# Altium project BBB_Board.PrjPCB (part 1 of 2)
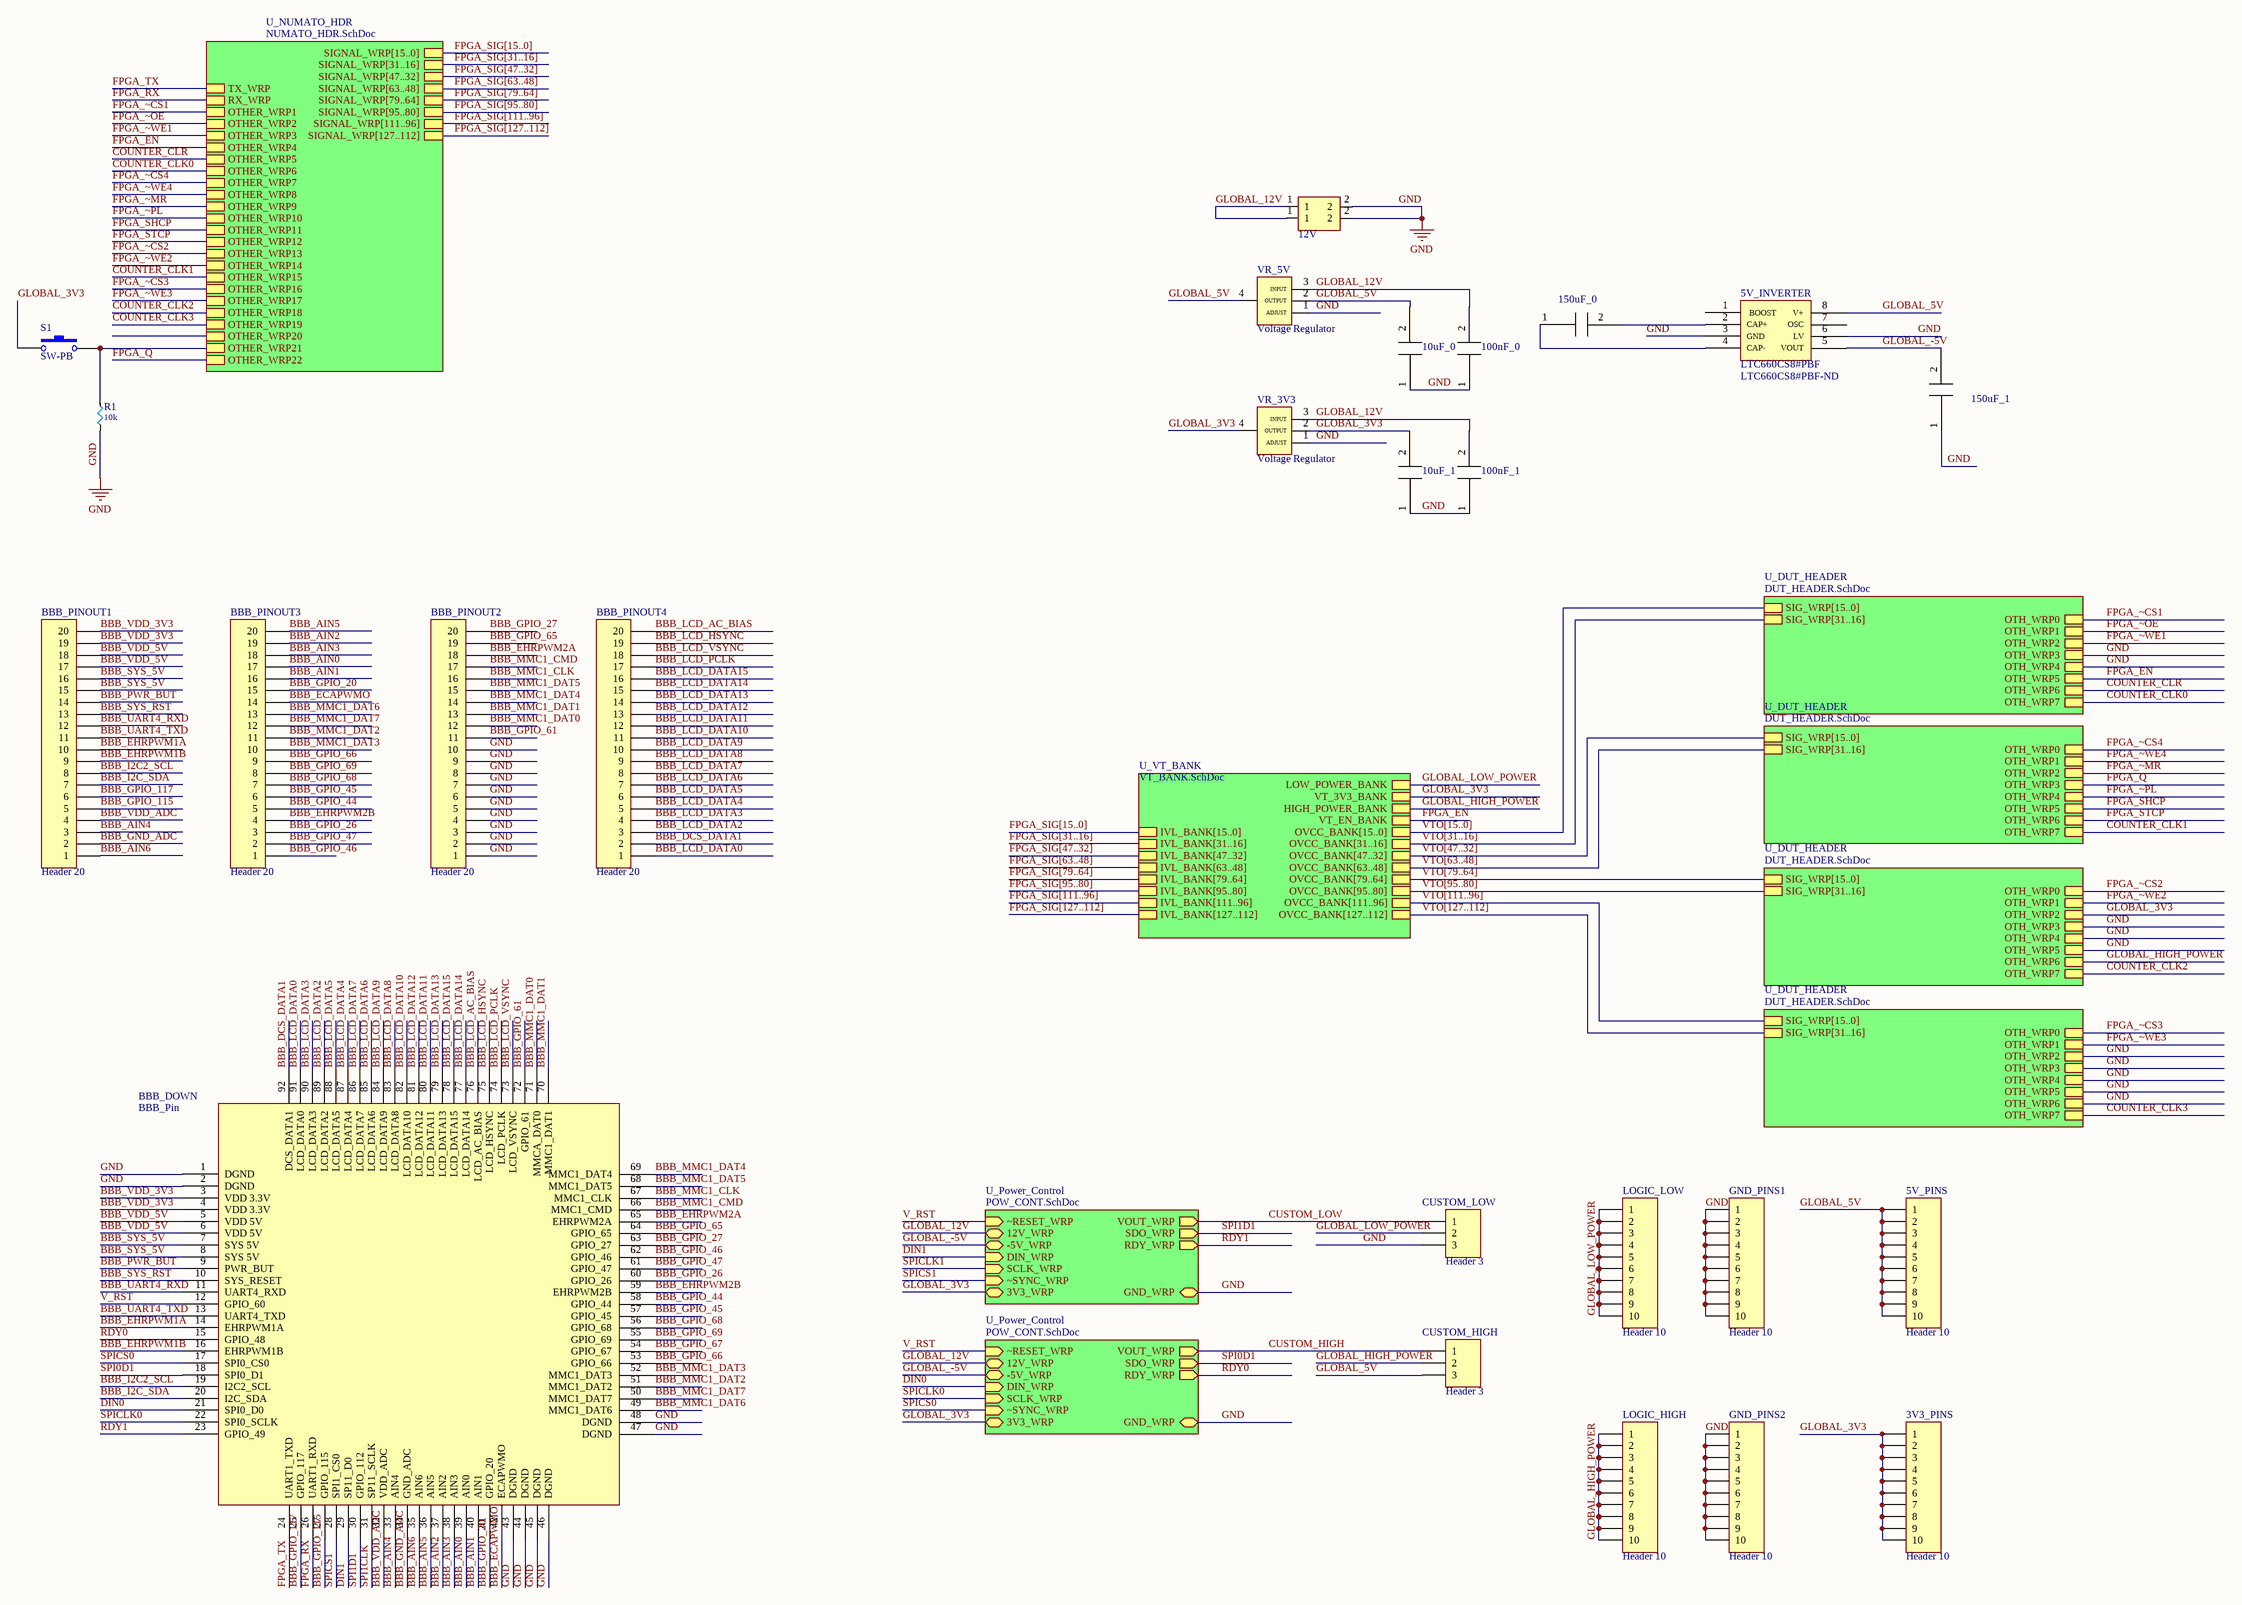
[diagram p0: BBB_Board.SchDoc]
6 sheets, 103 parts. Net scope: hierarchical (ports join the sheet entries above them; power ports are global).
Board files: BBB_Board_NEW.PcbDoc, BBB_Board_NEW_PLANES.PcbDoc
Sheets:
  BBB_Board.SchDoc
    U_Power_Control = POW_CONT.SchDoc
    U_Power_Control = POW_CONT.SchDoc
    U_VT_BANK = VT_BANK.SchDoc
      U_VT_WRP = VT_WRP.SchDoc
      U_VT_WRP = VT_WRP.SchDoc
      U_VT_WRP = VT_WRP.SchDoc
      U_VT_WRP = VT_WRP.SchDoc
      U_VT_WRP = VT_WRP.SchDoc
      U_VT_WRP = VT_WRP.SchDoc
      U_VT_WRP = VT_WRP.SchDoc
      U_VT_WRP = VT_WRP.SchDoc
    U_DUT_HEADER = DUT_HEADER.SchDoc
    U_DUT_HEADER = DUT_HEADER.SchDoc
    U_DUT_HEADER = DUT_HEADER.SchDoc
    U_DUT_HEADER = DUT_HEADER.SchDoc
    U_NUMATO_HDR = NUMATO_HDR.SchDoc

## Sheet BBB_Board.SchDoc
size C

### Parts
3V3_PINS  Header 10  [HDR1X10]
5V_INVERTER  LTC660CS8#PBF  Supplier Part Number 1: LTC660CS8#PBF-ND  [SOIC127P600X175-8N]
5V_PINS  Header 10  [HDR1X10]
10uF_0  0.1uF_0603  [0.1uF_0603]  (value not drawn)
10uF_1  0.1uF_0603  [0.1uF_0603]  (value not drawn)
12V  PJ-002BH-SMT-TR  [CP-002BHPJCT-ND]  (value not drawn)
100nF_0  0.1uF_0603  [0.1uF_0603]  (value not drawn)
100nF_1  0.1uF_0603  [0.1uF_0603]  (value not drawn)
150uF_0  0.1uF_0603  [0.1uF_0603]  (value not drawn)
150uF_1  0.1uF_0603  [0.1uF_0603]  (value not drawn)
BBB_DOWN  BBB_Pin  [BBB_Pin]
BBB_PINOUT1  Header 20  [HDR1X20]
BBB_PINOUT2  Header 20  [HDR1X20]
BBB_PINOUT3  Header 20  [HDR1X20]
BBB_PINOUT4  Header 20  [HDR1X20]
CUSTOM_HIGH  Header 3  [HDR1X3]
CUSTOM_LOW  Header 3  [HDR1X3]
GND_PINS1  Header 10  [HDR1X10]
GND_PINS2  Header 10  [HDR1X10]
LOGIC_HIGH  Header 10  [HDR1X10]
LOGIC_LOW  Header 10  [HDR1X10]
R1  Resistance (Ohms): 10k  [0.1uF_0603]  (hidden comment: RNCS0603BKE10K0)
S1  SW-PB  [SPST-2]
VR_3V3  Voltage Regulator  [volt_reg]
VR_5V  Voltage Regulator  [volt_reg]

### Sub-sheets
U_DUT_HEADER = DUT_HEADER.SchDoc: SIG_WRP[15..0], SIG_WRP[31..16], OTH_WRP0, OTH_WRP1, OTH_WRP2, OTH_WRP3, OTH_WRP4, OTH_WRP5, OTH_WRP6, OTH_WRP7
U_DUT_HEADER = DUT_HEADER.SchDoc: SIG_WRP[15..0], SIG_WRP[31..16], OTH_WRP0, OTH_WRP1, OTH_WRP2, OTH_WRP3, OTH_WRP4, OTH_WRP5, OTH_WRP6, OTH_WRP7
U_DUT_HEADER = DUT_HEADER.SchDoc: SIG_WRP[15..0], SIG_WRP[31..16], OTH_WRP0, OTH_WRP1, OTH_WRP2, OTH_WRP3, OTH_WRP4, OTH_WRP5, OTH_WRP6, OTH_WRP7
U_DUT_HEADER = DUT_HEADER.SchDoc: SIG_WRP[15..0], SIG_WRP[31..16], OTH_WRP0, OTH_WRP1, OTH_WRP2, OTH_WRP3, OTH_WRP4, OTH_WRP5, OTH_WRP6, OTH_WRP7
U_NUMATO_HDR = NUMATO_HDR.SchDoc: SIGNAL_WRP[15..0], SIGNAL_WRP[31..16], SIGNAL_WRP[47..32], SIGNAL_WRP[63..48], SIGNAL_WRP[79..64], SIGNAL_WRP[95..80], SIGNAL_WRP[111..96], SIGNAL_WRP[127..112], OTHER_WRP1, OTHER_WRP2, OTHER_WRP3, OTHER_WRP4, OTHER_WRP5, OTHER_WRP6, OTHER_WRP7, OTHER_WRP8, OTHER_WRP9, OTHER_WRP10, OTHER_WRP11, OTHER_WRP12, OTHER_WRP13, OTHER_WRP14, OTHER_WRP15, OTHER_WRP16, OTHER_WRP17, OTHER_WRP18, OTHER_WRP19, OTHER_WRP20, OTHER_WRP21, OTHER_WRP22, TX_WRP, RX_WRP
U_Power_Control = POW_CONT.SchDoc: ~RESET_WRP, VOUT_WRP, 12V_WRP, -5V_WRP, DIN_WRP, SCLK_WRP, ~SYNC_WRP, SDO_WRP, RDY_WRP, 3V3_WRP, GND_WRP
U_Power_Control = POW_CONT.SchDoc: ~RESET_WRP, VOUT_WRP, 12V_WRP, -5V_WRP, DIN_WRP, SCLK_WRP, ~SYNC_WRP, SDO_WRP, RDY_WRP, 3V3_WRP, GND_WRP
U_VT_BANK = VT_BANK.SchDoc: VT_3V3_BANK, HIGH_POWER_BANK, VT_EN_BANK, OVCC_BANK[15..0], OVCC_BANK[31..16], OVCC_BANK[47..32], OVCC_BANK[63..48], OVCC_BANK[79..64], OVCC_BANK[95..80], OVCC_BANK[111..96], OVCC_BANK[127..112], IVL_BANK[15..0], IVL_BANK[31..16], IVL_BANK[47..32], IVL_BANK[63..48], IVL_BANK[79..64], IVL_BANK[95..80], IVL_BANK[111..96], IVL_BANK[127..112], LOW_POWER_BANK

### Nets
GND: 5V_INVERTER.3(GND) 5V_INVERTER.6(LV) 10uF_0.1 10uF_1.1 12V.2 100nF_0.1 100nF_1.1 150uF_1.1 BBB_DOWN.1(DGND) BBB_DOWN.2(DGND) BBB_DOWN.43(DGND) BBB_DOWN.44(DGND) BBB_DOWN.45(DGND) BBB_DOWN.46(DGND) BBB_DOWN.47(DGND) BBB_DOWN.48(DGND) BBB_PINOUT2.1 BBB_PINOUT2.2 BBB_PINOUT2.3 BBB_PINOUT2.4 BBB_PINOUT2.5 BBB_PINOUT2.6 BBB_PINOUT2.7 BBB_PINOUT2.8 BBB_PINOUT2.9 BBB_PINOUT2.10 CUSTOM_LOW.3 GND_PINS1.1 GND_PINS1.2 GND_PINS1.3 GND_PINS1.4 GND_PINS1.5 GND_PINS1.6 GND_PINS1.7 GND_PINS1.8 GND_PINS1.9 GND_PINS1.10 GND_PINS2.1 GND_PINS2.2 GND_PINS2.3 GND_PINS2.4 GND_PINS2.5 GND_PINS2.6 GND_PINS2.7 GND_PINS2.8 GND_PINS2.9 GND_PINS2.10 R1.1 VR_3V3.1(ADJUST) VR_5V.1(ADJUST) ; sheet U_Power_Control/GND_WRP, sheet U_Power_Control/GND_WRP, sheet U_DUT_HEADER/OTH_WRP3, sheet U_DUT_HEADER/OTH_WRP4, sheet U_DUT_HEADER/OTH_WRP3, sheet U_DUT_HEADER/OTH_WRP4, sheet U_DUT_HEADER/OTH_WRP5, sheet U_DUT_HEADER/OTH_WRP2, sheet U_DUT_HEADER/OTH_WRP3, sheet U_DUT_HEADER/OTH_WRP4, sheet U_DUT_HEADER/OTH_WRP5, sheet U_DUT_HEADER/OTH_WRP6
BBB_AIN0: BBB_DOWN.39(AIN0) BBB_PINOUT3.17
BBB_AIN1: BBB_DOWN.40(AIN1) BBB_PINOUT3.16
BBB_AIN2: BBB_DOWN.37(AIN2) BBB_PINOUT3.19
BBB_AIN3: BBB_DOWN.38(AIN3) BBB_PINOUT3.18
BBB_AIN4: BBB_DOWN.33(AIN4) BBB_PINOUT1.3
BBB_AIN5: BBB_DOWN.36(AIN5) BBB_PINOUT3.20
BBB_AIN6: BBB_DOWN.35(AIN6) BBB_PINOUT1.1
BBB_DCS_DATA1: BBB_DOWN.92(DCS_DATA1) BBB_PINOUT4.2
BBB_ECAPWMO: BBB_DOWN.42(ECAPWMO) BBB_PINOUT3.14
BBB_EHRPWM1A: BBB_DOWN.14(EHRPWM1A) BBB_PINOUT1.10
BBB_EHRPWM1B: BBB_DOWN.16(EHRPWM1B) BBB_PINOUT1.9
BBB_EHRPWM2A: BBB_DOWN.65(EHRPWM2A) BBB_PINOUT2.18
BBB_EHRPWM2B: BBB_DOWN.59(EHRPWM2B) BBB_PINOUT3.4
BBB_GND_ADC: BBB_DOWN.34(GND_ADC) BBB_PINOUT1.2
BBB_GPIO_20: BBB_DOWN.41(GPIO_20) BBB_PINOUT3.15
BBB_GPIO_26: BBB_DOWN.60(GPIO_26) BBB_PINOUT3.3
BBB_GPIO_27: BBB_DOWN.63(GPIO_27) BBB_PINOUT2.20
BBB_GPIO_44: BBB_DOWN.58(GPIO_44) BBB_PINOUT3.5
BBB_GPIO_45: BBB_DOWN.57(GPIO_45) BBB_PINOUT3.6
BBB_GPIO_46: BBB_DOWN.62(GPIO_46) BBB_PINOUT3.1
BBB_GPIO_47: BBB_DOWN.61(GPIO_47) BBB_PINOUT3.2
BBB_GPIO_61: BBB_DOWN.72(GPIO_61) BBB_PINOUT2.11
BBB_GPIO_65: BBB_DOWN.64(GPIO_65) BBB_PINOUT2.19
BBB_GPIO_66: BBB_DOWN.53(GPIO_66) BBB_PINOUT3.9
BBB_GPIO_67: BBB_DOWN.54(GPIO_67)
BBB_GPIO_68: BBB_DOWN.56(GPIO_68) BBB_PINOUT3.7
BBB_GPIO_69: BBB_DOWN.55(GPIO_69) BBB_PINOUT3.8
BBB_GPIO_115: BBB_DOWN.27(GPIO_115) BBB_PINOUT1.5
BBB_GPIO_117: BBB_DOWN.25(GPIO_117) BBB_PINOUT1.6
BBB_I2C2_SCL: BBB_DOWN.19(I2C2_SCL) BBB_PINOUT1.8
BBB_I2C_SDA: BBB_DOWN.20(I2C_SDA) BBB_PINOUT1.7
BBB_LCD_AC_BIAS: BBB_DOWN.76(LCD_AC_BIAS) BBB_PINOUT4.20
BBB_LCD_DATA0: BBB_DOWN.91(LCD_DATA0) BBB_PINOUT4.1
BBB_LCD_DATA2: BBB_DOWN.89(LCD_DATA2) BBB_PINOUT4.3
BBB_LCD_DATA3: BBB_DOWN.90(LCD_DATA3) BBB_PINOUT4.4
BBB_LCD_DATA4: BBB_DOWN.87(LCD_DATA4) BBB_PINOUT4.5
BBB_LCD_DATA5: BBB_DOWN.88(LCD_DATA5) BBB_PINOUT4.6
BBB_LCD_DATA6: BBB_DOWN.85(LCD_DATA6) BBB_PINOUT4.7
BBB_LCD_DATA7: BBB_DOWN.86(LCD_DATA7) BBB_PINOUT4.8
BBB_LCD_DATA8: BBB_DOWN.83(LCD_DATA8) BBB_PINOUT4.9
BBB_LCD_DATA9: BBB_DOWN.84(LCD_DATA9) BBB_PINOUT4.10
BBB_LCD_DATA10: BBB_DOWN.82(LCD_DATA10) BBB_PINOUT4.11
BBB_LCD_DATA11: BBB_DOWN.80(LCD_DATA11) BBB_PINOUT4.12
BBB_LCD_DATA12: BBB_DOWN.81(LCD_DATA12) BBB_PINOUT4.13
BBB_LCD_DATA13: BBB_DOWN.79(LCD_DATA13) BBB_PINOUT4.14
BBB_LCD_DATA14: BBB_DOWN.77(LCD_DATA14) BBB_PINOUT4.15
BBB_LCD_DATA15: BBB_DOWN.78(LCD_DATA15) BBB_PINOUT4.16
BBB_LCD_HSYNC: BBB_DOWN.75(LCD_HSYNC) BBB_PINOUT4.19
BBB_LCD_PCLK: BBB_DOWN.74(LCD_PCLK) BBB_PINOUT4.17
BBB_LCD_VSYNC: BBB_DOWN.73(LCD_VSYNC) BBB_PINOUT4.18
BBB_MMC1_CLK: BBB_DOWN.67(MMC1_CLK) BBB_PINOUT2.16
BBB_MMC1_CMD: BBB_DOWN.66(MMC1_CMD) BBB_PINOUT2.17
BBB_MMC1_DAT0: BBB_DOWN.71(MMCA_DAT0) BBB_PINOUT2.12
BBB_MMC1_DAT1: BBB_DOWN.70(MMC1_DAT1) BBB_PINOUT2.13
BBB_MMC1_DAT2: BBB_DOWN.51(MMC1_DAT2) BBB_PINOUT3.11
BBB_MMC1_DAT3: BBB_DOWN.52(MMC1_DAT3) BBB_PINOUT3.10
BBB_MMC1_DAT4: BBB_DOWN.69(MMC1_DAT4) BBB_PINOUT2.14
BBB_MMC1_DAT5: BBB_DOWN.68(MMC1_DAT5) BBB_PINOUT2.15
BBB_MMC1_DAT6: BBB_DOWN.49(MMC1_DAT6) BBB_PINOUT3.13
BBB_MMC1_DAT7: BBB_DOWN.50(MMC1_DAT7) BBB_PINOUT3.12
BBB_PWR_BUT: BBB_DOWN.9(PWR_BUT) BBB_PINOUT1.14
BBB_SYS_5V: BBB_DOWN.7(SYS_5V) BBB_DOWN.8(SYS_5V) BBB_PINOUT1.15 BBB_PINOUT1.16
BBB_SYS_RST: BBB_DOWN.10(SYS_RESET) BBB_PINOUT1.13
BBB_UART4_RXD: BBB_DOWN.11(UART4_RXD) BBB_PINOUT1.12
BBB_UART4_TXD: BBB_DOWN.13(UART4_TXD) BBB_PINOUT1.11
BBB_VDD_3V3: BBB_DOWN.3(VDD_3.3V) BBB_DOWN.4(VDD_3.3V) BBB_PINOUT1.19 BBB_PINOUT1.20
BBB_VDD_5V: BBB_DOWN.5(VDD_5V) BBB_DOWN.6(VDD_5V) BBB_PINOUT1.17 BBB_PINOUT1.18
BBB_VDD_ADC: BBB_DOWN.32(VDD_ADC) BBB_PINOUT1.4
COUNTER_CLK0: sheet U_DUT_HEADER/OTH_WRP7, sheet U_NUMATO_HDR/OTHER_WRP6
COUNTER_CLK1: sheet U_DUT_HEADER/OTH_WRP7, sheet U_NUMATO_HDR/OTHER_WRP15
COUNTER_CLK2: sheet U_DUT_HEADER/OTH_WRP7, sheet U_NUMATO_HDR/OTHER_WRP18
COUNTER_CLK3: sheet U_DUT_HEADER/OTH_WRP7, sheet U_NUMATO_HDR/OTHER_WRP19
COUNTER_CLR: sheet U_DUT_HEADER/OTH_WRP6, sheet U_NUMATO_HDR/OTHER_WRP5
CUSTOM_HIGH: CUSTOM_HIGH.1 ; sheet U_Power_Control/VOUT_WRP
CUSTOM_LOW: CUSTOM_LOW.1 ; sheet U_Power_Control/VOUT_WRP
DIN0: BBB_DOWN.21(SPI0_D0) ; sheet U_Power_Control/DIN_WRP
DIN1: BBB_DOWN.29(SP11_D0) ; sheet U_Power_Control/DIN_WRP
FPGA_EN: sheet U_VT_BANK/VT_EN_BANK, sheet U_DUT_HEADER/OTH_WRP5, sheet U_NUMATO_HDR/OTHER_WRP4
FPGA_Q: sheet U_DUT_HEADER/OTH_WRP3, sheet U_NUMATO_HDR/OTHER_WRP22
FPGA_RX: BBB_DOWN.26(UART1_RXD) ; sheet U_NUMATO_HDR/RX_WRP
FPGA_SHCP: sheet U_DUT_HEADER/OTH_WRP5, sheet U_NUMATO_HDR/OTHER_WRP11
FPGA_STCP: sheet U_DUT_HEADER/OTH_WRP6, sheet U_NUMATO_HDR/OTHER_WRP12
FPGA_TX: BBB_DOWN.24(UART1_TXD) ; sheet U_NUMATO_HDR/TX_WRP
FPGA_~CS1: sheet U_DUT_HEADER/OTH_WRP0, sheet U_NUMATO_HDR/OTHER_WRP1
FPGA_~CS2: sheet U_DUT_HEADER/OTH_WRP0, sheet U_NUMATO_HDR/OTHER_WRP13
FPGA_~CS3: sheet U_DUT_HEADER/OTH_WRP0, sheet U_NUMATO_HDR/OTHER_WRP16
FPGA_~CS4: sheet U_DUT_HEADER/OTH_WRP0, sheet U_NUMATO_HDR/OTHER_WRP7
FPGA_~MR: sheet U_DUT_HEADER/OTH_WRP2, sheet U_NUMATO_HDR/OTHER_WRP9
FPGA_~OE: sheet U_DUT_HEADER/OTH_WRP1, sheet U_NUMATO_HDR/OTHER_WRP2
FPGA_~PL: sheet U_DUT_HEADER/OTH_WRP4, sheet U_NUMATO_HDR/OTHER_WRP10
FPGA_~WE1: sheet U_DUT_HEADER/OTH_WRP2, sheet U_NUMATO_HDR/OTHER_WRP3
FPGA_~WE2: sheet U_DUT_HEADER/OTH_WRP1, sheet U_NUMATO_HDR/OTHER_WRP14
FPGA_~WE3: sheet U_DUT_HEADER/OTH_WRP1, sheet U_NUMATO_HDR/OTHER_WRP17
FPGA_~WE4: sheet U_DUT_HEADER/OTH_WRP1, sheet U_NUMATO_HDR/OTHER_WRP8
GLOBAL_3V3: 3V3_PINS.1 3V3_PINS.2 3V3_PINS.3 3V3_PINS.4 3V3_PINS.5 3V3_PINS.6 3V3_PINS.7 3V3_PINS.8 3V3_PINS.9 3V3_PINS.10 10uF_1.2 S1.1 VR_3V3.2(OUTPUT) VR_3V3.4(Output) ; sheet U_Power_Control/3V3_WRP, sheet U_Power_Control/3V3_WRP, sheet U_VT_BANK/VT_3V3_BANK, sheet U_DUT_HEADER/OTH_WRP2  [project net 3V3_W]
GLOBAL_5V: 5V_INVERTER.8(V+) 5V_PINS.1 5V_PINS.2 5V_PINS.3 5V_PINS.4 5V_PINS.5 5V_PINS.6 5V_PINS.7 5V_PINS.8 5V_PINS.9 5V_PINS.10 10uF_0.2 CUSTOM_HIGH.3 VR_5V.2(OUTPUT) VR_5V.4(Output)
GLOBAL_12V: 12V.1 100nF_0.2 100nF_1.2 VR_3V3.3(INPUT) VR_5V.3(INPUT) ; sheet U_Power_Control/12V_WRP, sheet U_Power_Control/12V_WRP  [project net 12V_W]
GLOBAL_-5V: 5V_INVERTER.5(VOUT) 150uF_1.2 ; sheet U_Power_Control/-5V_WRP, sheet U_Power_Control/-5V_WRP  [project net -5V_W]
GLOBAL_HIGH_POWER: CUSTOM_HIGH.2 LOGIC_HIGH.1 LOGIC_HIGH.2 LOGIC_HIGH.3 LOGIC_HIGH.4 LOGIC_HIGH.5 LOGIC_HIGH.6 LOGIC_HIGH.7 LOGIC_HIGH.8 LOGIC_HIGH.9 LOGIC_HIGH.10 ; sheet U_VT_BANK/HIGH_POWER_BANK, sheet U_DUT_HEADER/OTH_WRP6
GLOBAL_LOW_POWER: CUSTOM_LOW.2 LOGIC_LOW.1 LOGIC_LOW.2 LOGIC_LOW.3 LOGIC_LOW.4 LOGIC_LOW.5 LOGIC_LOW.6 LOGIC_LOW.7 LOGIC_LOW.8 LOGIC_LOW.9 LOGIC_LOW.10 ; sheet U_VT_BANK/LOW_POWER_BANK
OTHER_W21: R1.2 S1.2 ; sheet U_NUMATO_HDR/OTHER_WRP21
RDY0: BBB_DOWN.15(GPIO_48) ; sheet U_Power_Control/RDY_WRP
RDY1: BBB_DOWN.23(GPIO_49) ; sheet U_Power_Control/RDY_WRP
SPI0D1: BBB_DOWN.18(SPI0_D1) ; sheet U_Power_Control/SDO_WRP  [project net SDO_W]
SPI1CLK: BBB_DOWN.31(SP11_SCLK)
SPI1D1: BBB_DOWN.30(GPIO_112) ; sheet U_Power_Control/SDO_WRP  [project net SDO_W]
SPICLK0: BBB_DOWN.22(SPI0_SCLK) ; sheet U_Power_Control/SCLK_WRP  [project net SCLK_W]
SPICS0: BBB_DOWN.17(SPI0_CS0) ; sheet U_Power_Control/~SYNC_WRP
SPICS1: BBB_DOWN.28(SPI1_CS0) ; sheet U_Power_Control/~SYNC_WRP
V_RST: BBB_DOWN.12(GPIO_60) ; sheet U_Power_Control/~RESET_WRP, sheet U_Power_Control/~RESET_WRP
Net5V_INVERTER_2: 5V_INVERTER.2(CAP+) 150uF_0.2
Net5V_INVERTER_4: 5V_INVERTER.4(CAP-) 150uF_0.1

Not connected (* = marked no-connect by the designer): 5V_INVERTER 1(BOOST) 7(OSC)

### Buses and harness runs
bus FPGA_SIG[15..0] = sheet U_NUMATO_HDR/SIGNAL_WRP[15..0]
bus FPGA_SIG[15..0] = sheet U_VT_BANK/IVL_BANK[15..0]
bus FPGA_SIG[31..16] = sheet U_NUMATO_HDR/SIGNAL_WRP[31..16]
bus FPGA_SIG[31..16] = sheet U_VT_BANK/IVL_BANK[31..16]
bus FPGA_SIG[47..32] = sheet U_NUMATO_HDR/SIGNAL_WRP[47..32]
bus FPGA_SIG[47..32] = sheet U_VT_BANK/IVL_BANK[47..32]
bus FPGA_SIG[63..48] = sheet U_NUMATO_HDR/SIGNAL_WRP[63..48]
bus FPGA_SIG[63..48] = sheet U_VT_BANK/IVL_BANK[63..48]
bus FPGA_SIG[79..64] = sheet U_NUMATO_HDR/SIGNAL_WRP[79..64]
bus FPGA_SIG[79..64] = sheet U_VT_BANK/IVL_BANK[79..64]
bus FPGA_SIG[95..80] = sheet U_NUMATO_HDR/SIGNAL_WRP[95..80]
bus FPGA_SIG[95..80] = sheet U_VT_BANK/IVL_BANK[95..80]
bus FPGA_SIG[111..96] = sheet U_NUMATO_HDR/SIGNAL_WRP[111..96]
bus FPGA_SIG[111..96] = sheet U_VT_BANK/IVL_BANK[111..96]
bus FPGA_SIG[127..112] = sheet U_NUMATO_HDR/SIGNAL_WRP[127..112]
bus FPGA_SIG[127..112] = sheet U_VT_BANK/IVL_BANK[127..112]
bus VTO[15..0] = sheet U_DUT_HEADER/SIG_WRP[15..0] = sheet U_VT_BANK/OVCC_BANK[15..0]
bus VTO[31..16] = sheet U_DUT_HEADER/SIG_WRP[31..16] = sheet U_VT_BANK/OVCC_BANK[31..16]
bus VTO[47..32] = sheet U_DUT_HEADER/SIG_WRP[15..0] = sheet U_VT_BANK/OVCC_BANK[47..32]
bus VTO[63..48] = sheet U_DUT_HEADER/SIG_WRP[31..16] = sheet U_VT_BANK/OVCC_BANK[63..48]
bus VTO[79..64] = sheet U_DUT_HEADER/SIG_WRP[15..0] = sheet U_VT_BANK/OVCC_BANK[79..64]
bus VTO[95..80] = sheet U_DUT_HEADER/SIG_WRP[31..16] = sheet U_VT_BANK/OVCC_BANK[95..80]
bus VTO[111..96] = sheet U_DUT_HEADER/SIG_WRP[15..0] = sheet U_VT_BANK/OVCC_BANK[111..96]
bus VTO[127..112] = sheet U_DUT_HEADER/SIG_WRP[31..16] = sheet U_VT_BANK/OVCC_BANK[127..112]

### Library data of the parts
3V3_PINS 5V_PINS GND_PINS1 GND_PINS2 LOGIC_HIGH LOGIC_LOW = Header 10: Header, 10-Pin; LatestRevisionDate: 17-Jul-2002; LatestRevisionNote: Re-released for DXP Platform.; Publisher: Altium Limited
5V_INVERTER = LTC660CS8#PBF: IC REG SWTCHD CAP INV 0.1A 8SOIC; Manufacturer: Linear Technology; Function: Ratiometric; Output Configuration: Positive or Negative; Topology: Charge Pump; Output Type: Fixed; Number of Outputs: 1; Voltage - Input (Min): 1.5V, 2.5V; Voltage - Input (Max): 5.5V; Voltage - Output (Min/Fixed): -Vin, 2Vin, Vin/2; Current - Output: 100mA; Frequency - Switching: 10kHz, 80kHz; Synchronous Rectifier: No; Supplier 1: Digi-Key; Manufacturer Part Number: LTC660CS8#PBF; RoHS: RoHS Compliant; Category: Integrated Circuits (ICs); Stock 1: 5170; Pricing 1: 1=5.53, 25=3.6704, 100=3.14 (USD); Packaging: Tube; Voltage - Output (Max): -; Operating Temperature: 0°C ~ 70°C (TA); Mounting Type: Surface Mount; Package / Case: 8-SOIC (0.154", 3.90mm Width); Supplier Device Package: 8-SOIC; ComponentLink1URL: http://www.linear.com/docs/1870; ComponentLink1Description: http://www.linear.com/docs/1870
12V = PJ-002BH-SMT-TR: CONN POWER JACK 2.5X5.5MM HI CUR; Manufacturer: CUI Inc; Gender: Male; Plug/Mating Plug Diameter: 2.5mm ID, 5.5mm OD; Number of Positions/Contacts: 2 Conductors, 3 Contacts; Internal Switch(s): Single Switch, Normally Closed; Shielding: Unshielded; Voltage - Rated: 24VDC; Current Rating: 5A; Supplier 1: Digi-Key; Manufacturer Part Number: PJ-002BH-SMT-TR; RoHS: RoHS Compliant; Category: Connectors, Interconnects; Stock 1: 6300; Pricing 1: 350=0.8588, 700=0.8136, 1050=0.7232, 1750=0.6554, 2450=0.60116, 8750=0.5763, 17500=0.565 (USD); Connector Type: Jack; Mounting Type: Surface Mount, Right Angle; Termination: Solder; Features: -; Color: Black; Contact Material: Copper Alloy; Contact Material - Plating: Nickel; Housing Color: Black; Housing Material: Thermoplastic; Operating Temperature: -25°C ~ 85°C; ComponentLink1URL: http://www.cui.com/product/resource/digikeypdf/pj-002bh-smt.pdf; ComponentLink1Description: http://www.cui.com/product/resource/digikeypdf/pj-002bh-smt.pdf; Supplier Part Number 1: CP-002BHPJTR-ND
BBB_PINOUT1-BBB_PINOUT4 = Header 20: Header, 20-Pin; LatestRevisionDate: 17-Jul-2002; LatestRevisionNote: Re-released for DXP Platform.; Publisher: Altium Limited
CUSTOM_HIGH CUSTOM_LOW = Header 3: Header, 3-Pin; LatestRevisionDate: 17-Jul-2002; LatestRevisionNote: Re-released for DXP Platform.; Publisher: Altium Limited
R1 = RNCS0603BKE10K0: RES 10K OHM 1/16W 0.1% 0603; Manufacturer: Stackpole Electronics Inc; Power (Watts): 0.063W, 1/16W; Temperature Coefficient: ±25ppm/°C; Supplier 1: Digi-Key; Manufacturer Part Number: RNCS0603BKE10K0; RoHS: RoHS Compliant; Category: Resistors; Stock 1: 32000; Pricing 1: 1000=0.08, 2000=0.075, 5000=0.0675, 10000=0.066, 25000=0.06375, 50000=0.0625, 100000=0.0619 (USD); Packaging: Tape & Reel (TR); Tolerance: ±0.1%; Composition: Thin Film; Features: Anti-Corrosive, Moisture Resistant; Package / Case: 0603 (1608 Metric); Supplier Device Package: 0603; Size / Dimension: 0.061" L x 0.031" W (1.55mm x 0.80mm); Height: 0.022" (0.55mm); Number of Terminations: 2; ComponentLink1URL: http://www.seielect.com/catalog/SEI-RNCS.pdf; ComponentLink1Description: http://www.seielect.com/catalog/SEI-RNCS.pdf; Supplier Part Number 1: RNCS0603BKE10K0TR-ND
S1 = SW-PB: Switch; Published: 24-Mar-1999; LatestRevisionDate: 17-Jul-2002; LatestRevisionNote: Re-released for DXP Platform.; PackageReference: SPST-2; Publisher: Altium Limited; PackageDescription: Switch; 2 Leads
VR_3V3 VR_5V = Voltage Regulator: IC REG LDO ADJ 1.5A DDPAK; Manufacturer: Texas Instruments; Manufacturer Part Number: LM317KTTR; Regulator Topology: Positive Adjustable; Voltage - Output: 1.25 V ~ 37 V; Number of Regulators: 1; Voltage - Input: 4.2 V ~ 40 V; Supplier 1: Digi-Key; RoHS: RoHS Compliant; Category: Integrated Circuits (ICs); Stock 1: 23750; Pricing 1: 1=0.93, 10=0.816, 100=0.624 (USD); Packaging: Cut Tape (CT); Current - Output: 1.5A; Voltage - Dropout (Typical): -; Current - Limit (Min): -; Operating Temperature: 0°C ~ 125°C; Mounting Type: Surface Mount; Package / Case: TO-263-4, D²Pak (3 Leads + Tab), TO-263AA; Supplier Device Package: DDPAK/TO-263-3; ComponentLink1URL: http://www.ti.com/lit/ds/symlink/lm317.pdf; ComponentLink1Description: http://www.ti.com/lit/ds/symlink/lm317.pdf; Supplier Part Number 1: 296-21390-1-ND

## Sheet POW_CONT.SchDoc
size A
Used 2 times, as channels U_Power_Control, U_Power_Control. Parts and nets are listed once, with the designators drawn on the sheet.
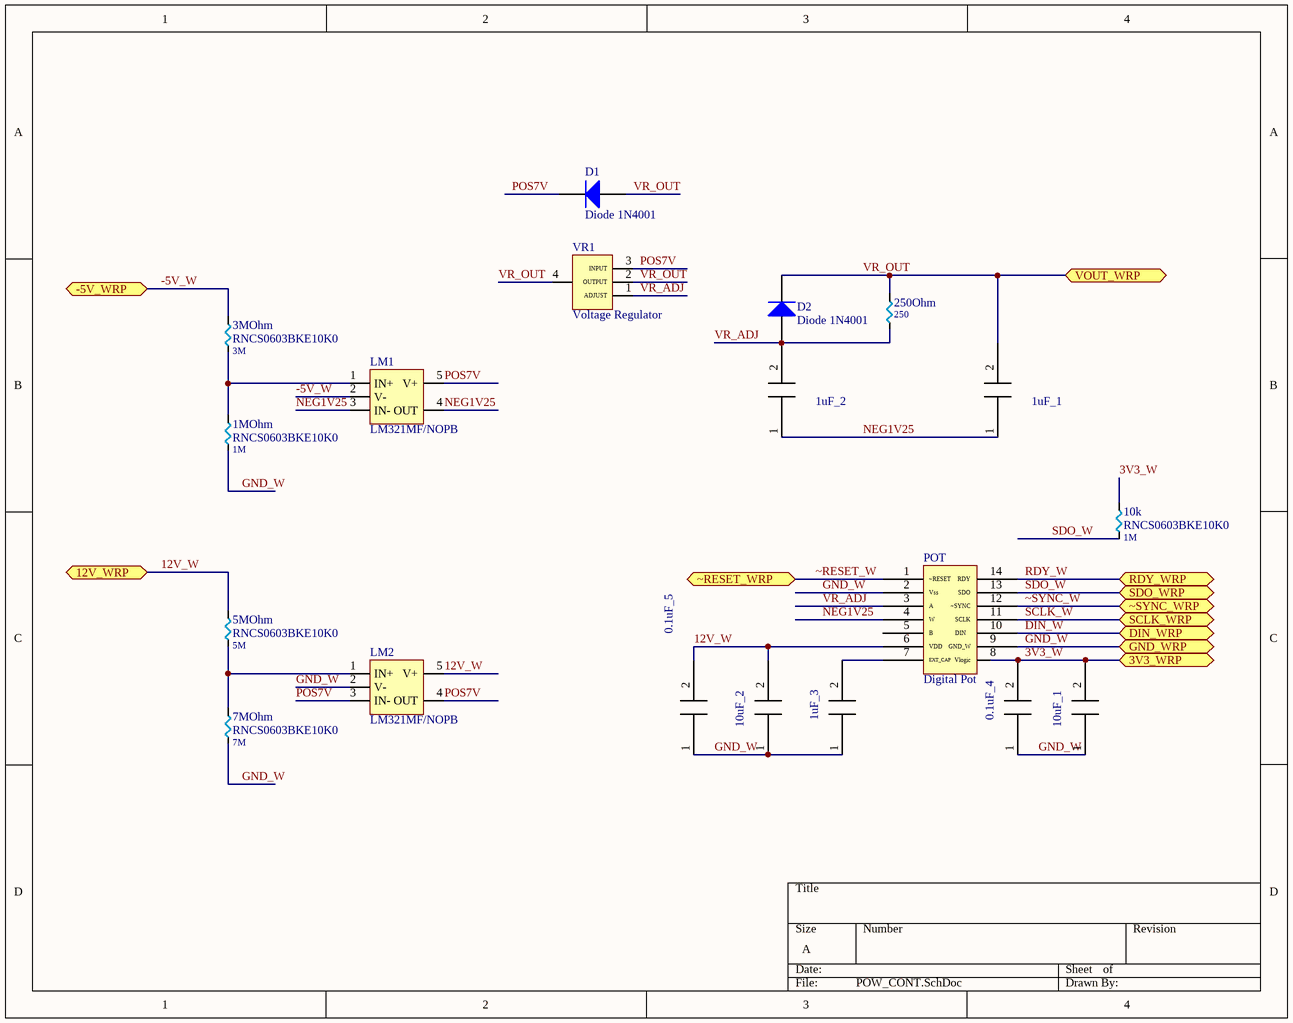
[diagram p1: POW_CONT.SchDoc]

### Parts
0.1uF_4  0.1uF_0603  [0.1uF_0603]  (value not drawn)
0.1uF_5  0.1uF_0603  [0.1uF_0603]  (value not drawn)
1MOhm  RNCS0603BKE10K0  Resistance (Ohms): 1M  [0.1uF_0603]
1uF_1  0.1uF_0603  [0.1uF_0603]  (value not drawn)
1uF_2  0.1uF_0603  [0.1uF_0603]  (value not drawn)
1uF_3  0.1uF_0603  [0.1uF_0603]  (value not drawn)
3MOhm  RNCS0603BKE10K0  Resistance (Ohms): 3M  [0.1uF_0603]
5MOhm  RNCS0603BKE10K0  Resistance (Ohms): 5M  [0.1uF_0603]
7MOhm  RNCS0603BKE10K0  Resistance (Ohms): 7M  [0.1uF_0603]
10k  RNCS0603BKE10K0  Resistance (Ohms): 1M  [0.1uF_0603]
10uF_1  0.1uF_0603  [0.1uF_0603]  (value not drawn)
10uF_2  0.1uF_0603  [0.1uF_0603]  (value not drawn)
250Ohm  Resistance (Ohms): 250  [0.1uF_0603]  (hidden comment: RNCS0603BKE10K0)
D1  Diode 1N4001  [DO-41]
D2  Diode 1N4001  [DO-41]
LM1  LM321MF/NOPB  [op_amp]
LM2  LM321MF/NOPB  [op_amp]
POT  Digital Pot  [Dig_Pot]
VR1  Voltage Regulator  [volt_reg]

### Ports
3V3_WRP, 12V_WRP, -5V_WRP, DIN_WRP, GND_WRP, RDY_WRP, SCLK_WRP, SDO_WRP, VOUT_WRP, ~RESET_WRP, ~SYNC_WRP

### Nets
3V3_W: 0.1uF_4.2 10k.2 10uF_1.2 POT.8(Vlogic) ; port 3V3_WRP
12V_W: 0.1uF_5.2 5MOhm.2 10uF_2.2 LM2.5(V+) POT.6(VDD) ; port 12V_WRP
-5V_W: 3MOhm.2 LM1.2(V-) ; port -5V_WRP
DIN_W: POT.10(DIN) ; port DIN_WRP
GND_W: 0.1uF_4.1 0.1uF_5.1 1MOhm.1 1uF_3.1 7MOhm.1 10uF_1.1 10uF_2.1 LM2.2(V-) POT.2(Vss) POT.9(GND_W) ; port GND_WRP
NEG1V25: 1uF_1.1 1uF_2.1 LM1.3(IN-) LM1.4(OUT) POT.4(W)
POS7V: D1.2(K) LM1.5(V+) LM2.3(IN-) LM2.4(OUT) VR1.3(INPUT)
RDY_W: POT.14(RDY) ; port RDY_WRP
SCLK_W: POT.11(SCLK) ; port SCLK_WRP
SDO_W: 10k.1 POT.13(SDO) ; port SDO_WRP
VR_ADJ: 1uF_2.2 250Ohm.1 D2.1(A) POT.3(A) VR1.1(ADJUST)
VR_OUT: 1uF_1.2 250Ohm.2 D1.1(A) D2.2(K) VR1.2(OUTPUT) VR1.4(Output) ; port VOUT_WRP
~RESET_W: POT.1(~RESET) ; port ~RESET_WRP
~SYNC_W: POT.12(~SYNC) ; port ~SYNC_WRP
Net1MOhm_2: 1MOhm.2 3MOhm.1 LM1.1(IN+)
Net1uF_3_2: 1uF_3.2 POT.7(EXT_CAP)
Net5MOhm_1: 5MOhm.1 7MOhm.2 LM2.1(IN+)

Not connected (* = marked no-connect by the designer): POT 5(B)

### Channels
U_Power_Control: designators end in _U_Power_Control2; ports 3V3_WRP=3V3_W 12V_WRP=12V_W -5V_WRP=-5V_W DIN_WRP=DIN0 GND_WRP=GND RDY_WRP=RDY0 SCLK_WRP=SCLK_W SDO_WRP=SDO_W VOUT_WRP=CUSTOM_HIGH ~RESET_WRP=V_RST ~SYNC_WRP=SPICS0
U_Power_Control: designators end in _U_Power_Control1; ports 3V3_WRP=3V3_W 12V_WRP=12V_W -5V_WRP=-5V_W DIN_WRP=DIN1 GND_WRP=GND RDY_WRP=RDY1 SCLK_WRP=SCLK_W_U_Power_Control SDO_WRP=SDO_W VOUT_WRP=CUSTOM_LOW ~RESET_WRP=V_RST ~SYNC_WRP=SPICS1

### Library data of the parts
1MOhm 3MOhm 5MOhm 7MOhm 10k 250Ohm = RNCS0603BKE10K0: as R1 on sheet BBB_Board; Supplier 1: Digi-Key; Manufacturer Part Number: RNCS0603BKE10K0; RoHS: RoHS Compliant; Category: Resistors; Stock 1: 32000; Pricing 1: 1000=0.08, 2000=0.075, 5000=0.0675, 10000=0.066, 25000=0.06375, 50000=0.0625, 100000=0.0619 (USD); Packaging: Tape & Reel (TR); Tolerance: ±0.1%; Composition: Thin Film; Features: Anti-Corrosive, Moisture Resistant; Package / Case: 0603 (1608 Metric); Supplier Device Package: 0603; Size / Dimension: 0.061" L x 0.031" W (1.55mm x 0.80mm); Height: 0.022" (0.55mm); Number of Terminations: 2; ComponentLink1URL: http://www.seielect.com/catalog/SEI-RNCS.pdf; ComponentLink1Description: http://www.seielect.com/catalog/SEI-RNCS.pdf; Supplier Part Number 1: RNCS0603BKE10K0TR-ND
D1 D2 = Diode 1N4001: 1 Amp General Purpose Rectifier; Published: 8-Jun-2000; LatestRevisionDate: 17-Jul-2002; LatestRevisionNote: Re-released for DXP Platform.; DatasheetVersion: 1998; PackageVersion: Aug-1999; PackageReference: DO-41; Publisher: Altium Limited; PackageDescription: Diode, Axial; Body 5.2 x 2.7 mm (LxDia. max), Lead Dia. 0.86 mm (max); Code_JEDEC: DO-204-AL; ComponentLink1Description: Manufacturer Link; ComponentLink1URL: http://www.fairchildsemi.com/; ComponentLink2Description: Datasheet; ComponentLink2URL: http://www.fairchildsemi.com/ds/1N%2F1N4001.pdf
LM1 LM2 = LM321MF/NOPB: IC OPAMP GP 1MHZ SOT23-5; Manufacturer: Texas Instruments; Amplifier Type: General Purpose; Number of Circuits: 1; Slew Rate: 0.4 V/µs; Current - Input Bias: 45nA; Voltage - Input Offset: 2mV; Current - Supply: 660µA; Current - Output / Channel: 40mA; Voltage - Supply, Single/Dual (±): 3 V ~ 30 V, ±1.5 V ~ 15 V; Supplier 1: Digi-Key; Manufacturer Part Number: LM321MF/NOPB; RoHS: RoHS Compliant; Category: Integrated Circuits (ICs); Stock 1: 14679; Pricing 1: 1=0.67, 10=0.573, 100=0.4277, 500=0.33596 (USD); Packaging: Cut Tape (CT); Output Type: -; Gain Bandwidth Product: 1MHz; -3db Bandwidth: -; Operating Temperature: -40°C ~ 85°C; Mounting Type: Surface Mount; Package / Case: SC-74A, SOT-753; Supplier Device Package: SOT-23-5; ComponentLink1URL: http://www.ti.com/lit/ds/symlink/lm321.pdf; ComponentLink1Description: http://www.ti.com/lit/ds/symlink/lm321.pdf; Supplier Part Number 1: LM321MF/NOPBCT-ND
POT = Digital Pot: IC DGTL POT 1024POS 20K 14TSSOP; Manufacturer: Analog Devices Inc.; Manufacturer Part Number: AD5293BRUZ-20; Configuration: Potentiometer; Number of Circuits: 1; Number of Taps: 1024; Interface: SPI; Memory Type: Volatile; Voltage - Supply: 9 V ~ 33 V, ±9 V ~ 16.5 V; Tolerance: ±7%; Temperature Coefficient (Typ): 35 ppm/°C; Resistance - Wiper (Ohms) (Typ): 60; Supplier 1: Digi-Key; RoHS: RoHS Compliant; Category: Integrated Circuits (ICs); Stock 1: 271; Pricing 1: 1=6.13, 96=5.27771, 192=4.5826, 576=3.99047, 1056=3.47558, 2592=3.34685, 5000=3.252 (USD); Packaging: Tube; Taper: Linear; Resistance (Ohms): 20k; Features: -; Operating Temperature: -40°C ~ 105°C; Package / Case: 14-TSSOP (0.173", 4.40mm Width); Supplier Device Package: 14-TSSOP; ComponentLink1URL: http://www.analog.com/media/en/technical-documentation/data-sheets/AD5293.pdf; ComponentLink1Description: http://www.analog.com/media/en/technical-documentation/data-sheets/AD5293.pdf; Supplier Part Number 1: AD5293BRUZ-20-ND
VR1 = Voltage Regulator: as VR_3V3 on sheet BBB_Board; Supplier 1: Digi-Key; RoHS: RoHS Compliant; Category: Integrated Circuits (ICs); Stock 1: 23750; Pricing 1: 1=0.93, 10=0.816, 100=0.624 (USD); Packaging: Cut Tape (CT); Current - Output: 1.5A; Voltage - Dropout (Typical): -; Current - Limit (Min): -; Operating Temperature: 0°C ~ 125°C; Mounting Type: Surface Mount; Package / Case: TO-263-4, D²Pak (3 Leads + Tab), TO-263AA; Supplier Device Package: DDPAK/TO-263-3; ComponentLink1URL: http://www.ti.com/lit/ds/symlink/lm317.pdf; ComponentLink1Description: http://www.ti.com/lit/ds/symlink/lm317.pdf; Supplier Part Number 1: 296-21390-1-ND

## Sheet VT_BANK.SchDoc
size B
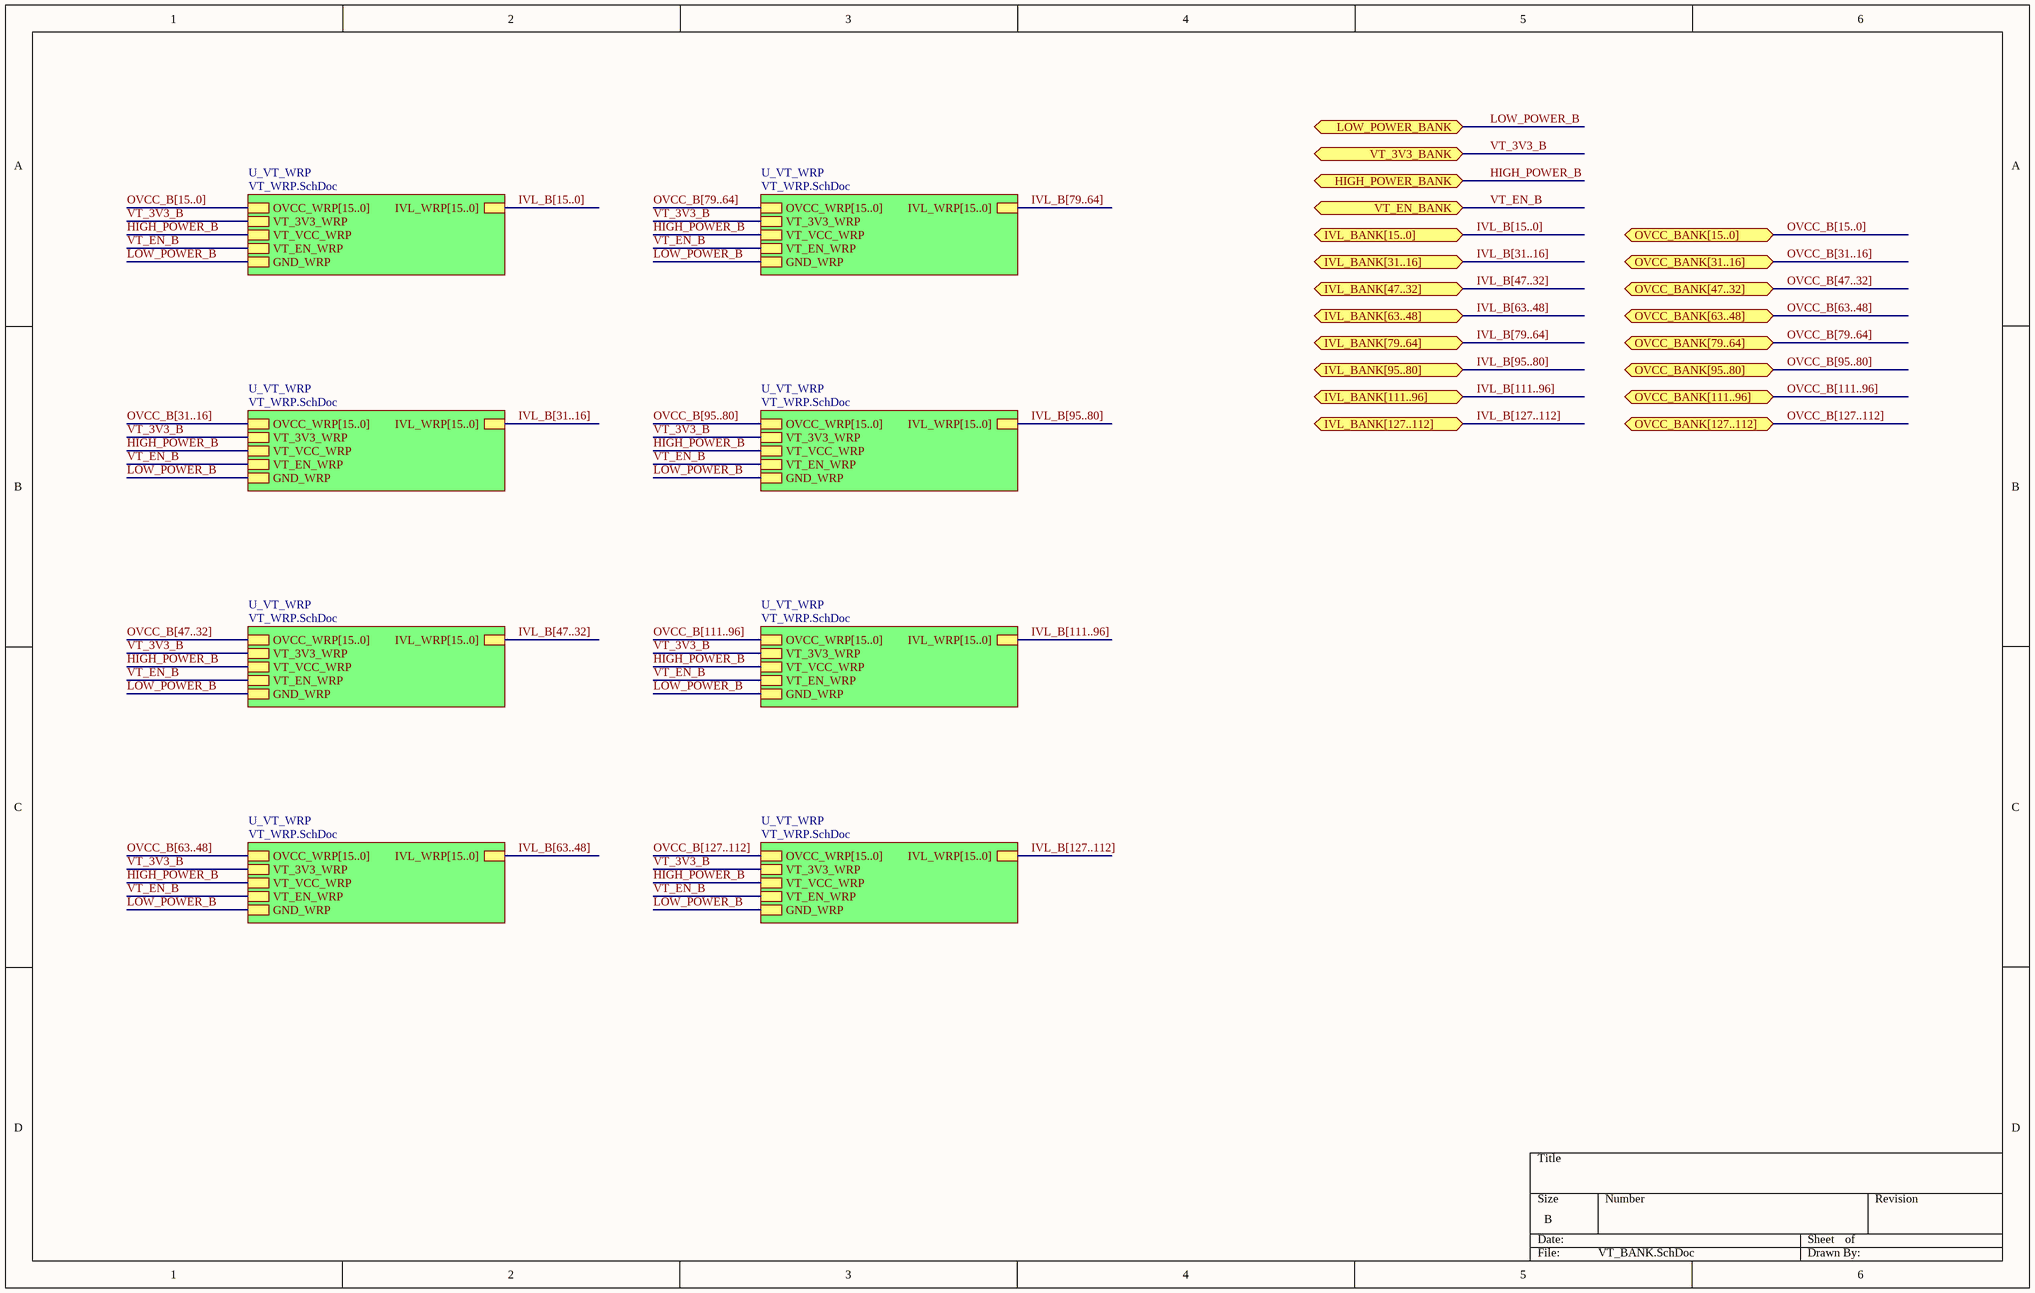
[diagram p2: VT_BANK.SchDoc]

### Sub-sheets
U_VT_WRP = VT_WRP.SchDoc: OVCC_WRP[15..0], IVL_WRP[15..0], VT_3V3_WRP, VT_VCC_WRP, VT_EN_WRP, GND_WRP
U_VT_WRP = VT_WRP.SchDoc: OVCC_WRP[15..0], IVL_WRP[15..0], VT_3V3_WRP, VT_VCC_WRP, VT_EN_WRP, GND_WRP
U_VT_WRP = VT_WRP.SchDoc: OVCC_WRP[15..0], IVL_WRP[15..0], VT_3V3_WRP, VT_VCC_WRP, VT_EN_WRP, GND_WRP
U_VT_WRP = VT_WRP.SchDoc: OVCC_WRP[15..0], IVL_WRP[15..0], VT_3V3_WRP, VT_VCC_WRP, VT_EN_WRP, GND_WRP
U_VT_WRP = VT_WRP.SchDoc: OVCC_WRP[15..0], IVL_WRP[15..0], VT_3V3_WRP, VT_VCC_WRP, VT_EN_WRP, GND_WRP
U_VT_WRP = VT_WRP.SchDoc: OVCC_WRP[15..0], IVL_WRP[15..0], VT_3V3_WRP, VT_VCC_WRP, VT_EN_WRP, GND_WRP
U_VT_WRP = VT_WRP.SchDoc: OVCC_WRP[15..0], IVL_WRP[15..0], VT_3V3_WRP, VT_VCC_WRP, VT_EN_WRP, GND_WRP
U_VT_WRP = VT_WRP.SchDoc: OVCC_WRP[15..0], IVL_WRP[15..0], VT_3V3_WRP, VT_VCC_WRP, VT_EN_WRP, GND_WRP

### Ports
HIGH_POWER_BANK, IVL_BANK[15..0], IVL_BANK[31..16], IVL_BANK[47..32], IVL_BANK[63..48], IVL_BANK[79..64], IVL_BANK[95..80], IVL_BANK[111..96], IVL_BANK[127..112], LOW_POWER_BANK, OVCC_BANK[15..0], OVCC_BANK[31..16], OVCC_BANK[47..32], OVCC_BANK[63..48], OVCC_BANK[79..64], OVCC_BANK[95..80], OVCC_BANK[111..96], OVCC_BANK[127..112], VT_3V3_BANK, VT_EN_BANK

### Nets
HIGH_POWER_B: port HIGH_POWER_BANK, sheet U_VT_WRP/VT_VCC_WRP, sheet U_VT_WRP/VT_VCC_WRP, sheet U_VT_WRP/VT_VCC_WRP, sheet U_VT_WRP/VT_VCC_WRP, sheet U_VT_WRP/VT_VCC_WRP, sheet U_VT_WRP/VT_VCC_WRP, sheet U_VT_WRP/VT_VCC_WRP, sheet U_VT_WRP/VT_VCC_WRP  [project net GLOBAL_HIGH_POWER]
LOW_POWER_B: port LOW_POWER_BANK, sheet U_VT_WRP/GND_WRP, sheet U_VT_WRP/GND_WRP, sheet U_VT_WRP/GND_WRP, sheet U_VT_WRP/GND_WRP, sheet U_VT_WRP/GND_WRP, sheet U_VT_WRP/GND_WRP, sheet U_VT_WRP/GND_WRP, sheet U_VT_WRP/GND_WRP  [project net GLOBAL_LOW_POWER]
VT_3V3_B: port VT_3V3_BANK, sheet U_VT_WRP/VT_3V3_WRP, sheet U_VT_WRP/VT_3V3_WRP, sheet U_VT_WRP/VT_3V3_WRP, sheet U_VT_WRP/VT_3V3_WRP, sheet U_VT_WRP/VT_3V3_WRP, sheet U_VT_WRP/VT_3V3_WRP, sheet U_VT_WRP/VT_3V3_WRP, sheet U_VT_WRP/VT_3V3_WRP  [project net 3V3_W]
VT_EN_B: port VT_EN_BANK, sheet U_VT_WRP/VT_EN_WRP, sheet U_VT_WRP/VT_EN_WRP, sheet U_VT_WRP/VT_EN_WRP, sheet U_VT_WRP/VT_EN_WRP, sheet U_VT_WRP/VT_EN_WRP, sheet U_VT_WRP/VT_EN_WRP, sheet U_VT_WRP/VT_EN_WRP, sheet U_VT_WRP/VT_EN_WRP  [project net FPGA_EN]

### Buses and harness runs
bus IVL_B[15..0] = port IVL_BANK[15..0]
bus IVL_B[15..0] = sheet U_VT_WRP/IVL_WRP[15..0]
bus IVL_B[31..16] = port IVL_BANK[31..16]
bus IVL_B[31..16] = sheet U_VT_WRP/IVL_WRP[15..0]
bus IVL_B[47..32] = port IVL_BANK[47..32]
bus IVL_B[47..32] = sheet U_VT_WRP/IVL_WRP[15..0]
bus IVL_B[63..48] = port IVL_BANK[63..48]
bus IVL_B[63..48] = sheet U_VT_WRP/IVL_WRP[15..0]
bus IVL_B[79..64] = port IVL_BANK[79..64]
bus IVL_B[79..64] = sheet U_VT_WRP/IVL_WRP[15..0]
bus IVL_B[95..80] = port IVL_BANK[95..80]
bus IVL_B[95..80] = sheet U_VT_WRP/IVL_WRP[15..0]
bus IVL_B[111..96] = port IVL_BANK[111..96]
bus IVL_B[111..96] = sheet U_VT_WRP/IVL_WRP[15..0]
bus IVL_B[127..112] = port IVL_BANK[127..112]
bus IVL_B[127..112] = sheet U_VT_WRP/IVL_WRP[15..0]
bus OVCC_B[15..0] = port OVCC_BANK[15..0]
bus OVCC_B[15..0] = sheet U_VT_WRP/OVCC_WRP[15..0]
bus OVCC_B[31..16] = port OVCC_BANK[31..16]
bus OVCC_B[31..16] = sheet U_VT_WRP/OVCC_WRP[15..0]
bus OVCC_B[47..32] = port OVCC_BANK[47..32]
bus OVCC_B[47..32] = sheet U_VT_WRP/OVCC_WRP[15..0]
bus OVCC_B[63..48] = port OVCC_BANK[63..48]
bus OVCC_B[63..48] = sheet U_VT_WRP/OVCC_WRP[15..0]
bus OVCC_B[79..64] = port OVCC_BANK[79..64]
bus OVCC_B[79..64] = sheet U_VT_WRP/OVCC_WRP[15..0]
bus OVCC_B[95..80] = port OVCC_BANK[95..80]
bus OVCC_B[95..80] = sheet U_VT_WRP/OVCC_WRP[15..0]
bus OVCC_B[111..96] = port OVCC_BANK[111..96]
bus OVCC_B[111..96] = sheet U_VT_WRP/OVCC_WRP[15..0]
bus OVCC_B[127..112] = port OVCC_BANK[127..112]
bus OVCC_B[127..112] = sheet U_VT_WRP/OVCC_WRP[15..0]

## Sheet VT_WRP.SchDoc
size A
Used 8 times, as channels U_VT_BANK/U_VT_WRP, U_VT_BANK/U_VT_WRP, U_VT_BANK/U_VT_WRP, U_VT_BANK/U_VT_WRP, U_VT_BANK/U_VT_WRP, U_VT_BANK/U_VT_WRP, U_VT_BANK/U_VT_WRP, U_VT_BANK/U_VT_WRP. Parts and nets are listed once, with the designators drawn on the sheet.
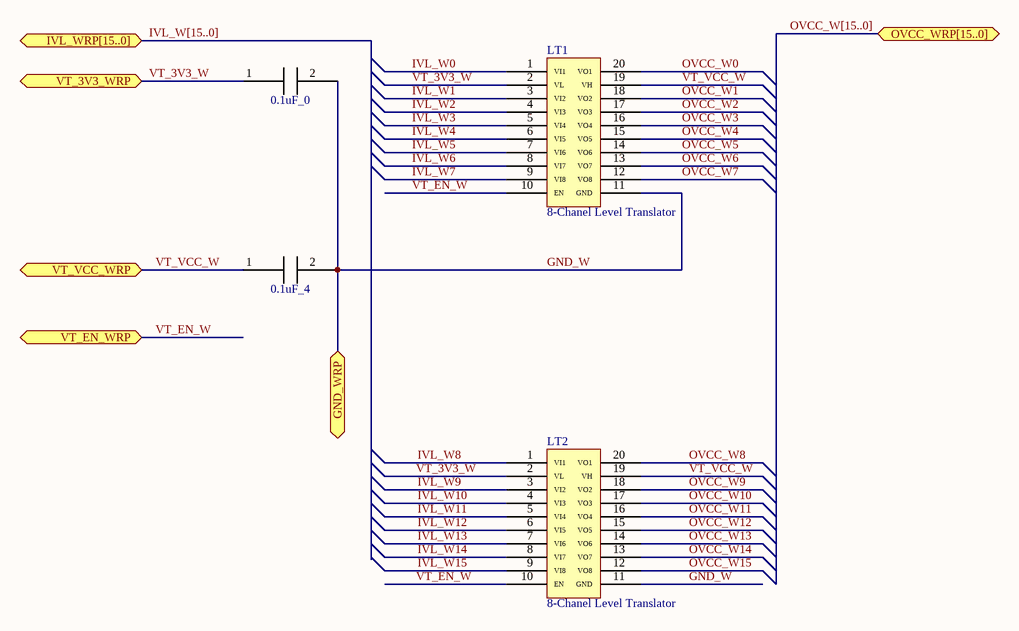
[diagram p3: VT_WRP.SchDoc]

### Parts
0.1uF_0  0.1uF_0603  [0.1uF_0603]  (value not drawn)
0.1uF_4  0.1uF_0603  [0.1uF_0603]  (value not drawn)
LT1  8-Chanel Level Translator  [8-bit_level]
LT2  8-Chanel Level Translator  [8-bit_level]

### Ports
GND_WRP, IVL_WRP[15..0], OVCC_WRP[15..0], VT_3V3_WRP, VT_EN_WRP, VT_VCC_WRP

### Nets
GND_W: 0.1uF_0.2 0.1uF_4.2 LT1.11(GND) LT2.11(GND) ; port GND_WRP
IVL_W0: LT1.1(VI1)
IVL_W1: LT1.3(VI2)
IVL_W2: LT1.4(VI3)
IVL_W3: LT1.5(VI4)
IVL_W4: LT1.6(VI5)
IVL_W5: LT1.7(VI6)
IVL_W6: LT1.8(VI7)
IVL_W7: LT1.9(VI8)
IVL_W8: LT2.1(VI1)
IVL_W9: LT2.3(VI2)
IVL_W10: LT2.4(VI3)
IVL_W11: LT2.5(VI4)
IVL_W12: LT2.6(VI5)
IVL_W13: LT2.7(VI6)
IVL_W14: LT2.8(VI7)
IVL_W15: LT2.9(VI8)
OVCC_W0: LT1.20(VO1)
OVCC_W1: LT1.18(VO2)
OVCC_W2: LT1.17(VO3)
OVCC_W3: LT1.16(VO4)
OVCC_W4: LT1.15(VO5)
OVCC_W5: LT1.14(VO6)
OVCC_W6: LT1.13(VO7)
OVCC_W7: LT1.12(VO8)
OVCC_W8: LT2.20(VO1)
OVCC_W9: LT2.18(VO2)
OVCC_W10: LT2.17(VO3)
OVCC_W11: LT2.16(VO4)
OVCC_W12: LT2.15(VO5)
OVCC_W13: LT2.14(VO6)
OVCC_W14: LT2.13(VO7)
OVCC_W15: LT2.12(VO8)
VT_3V3_W: 0.1uF_0.1 LT1.2(VL) LT2.2(VL) ; port VT_3V3_WRP
VT_EN_W: LT1.10(EN) LT2.10(EN) ; port VT_EN_WRP
VT_VCC_W: 0.1uF_4.1 LT1.19(VH) LT2.19(VH) ; port VT_VCC_WRP

### Channels
U_VT_BANK/U_VT_WRP: designators end in _U_VT_WRP8; ports GND_WRP=GLOBAL_LOW_POWER VT_3V3_WRP=3V3_W VT_EN_WRP=FPGA_EN VT_VCC_WRP=GLOBAL_HIGH_POWER
U_VT_BANK/U_VT_WRP: designators end in _U_VT_WRP7; ports GND_WRP=GLOBAL_LOW_POWER VT_3V3_WRP=3V3_W VT_EN_WRP=FPGA_EN VT_VCC_WRP=GLOBAL_HIGH_POWER
U_VT_BANK/U_VT_WRP: designators end in _U_VT_WRP6; ports GND_WRP=GLOBAL_LOW_POWER VT_3V3_WRP=3V3_W VT_EN_WRP=FPGA_EN VT_VCC_WRP=GLOBAL_HIGH_POWER
U_VT_BANK/U_VT_WRP: designators end in _U_VT_WRP5; ports GND_WRP=GLOBAL_LOW_POWER VT_3V3_WRP=3V3_W VT_EN_WRP=FPGA_EN VT_VCC_WRP=GLOBAL_HIGH_POWER
U_VT_BANK/U_VT_WRP: designators end in _U_VT_WRP4; ports GND_WRP=GLOBAL_LOW_POWER VT_3V3_WRP=3V3_W VT_EN_WRP=FPGA_EN VT_VCC_WRP=GLOBAL_HIGH_POWER
U_VT_BANK/U_VT_WRP: designators end in _U_VT_WRP3; ports GND_WRP=GLOBAL_LOW_POWER VT_3V3_WRP=3V3_W VT_EN_WRP=FPGA_EN VT_VCC_WRP=GLOBAL_HIGH_POWER
U_VT_BANK/U_VT_WRP: designators end in _U_VT_WRP2; ports GND_WRP=GLOBAL_LOW_POWER VT_3V3_WRP=3V3_W VT_EN_WRP=FPGA_EN VT_VCC_WRP=GLOBAL_HIGH_POWER
U_VT_BANK/U_VT_WRP: designators end in _U_VT_WRP1; ports GND_WRP=GLOBAL_LOW_POWER VT_3V3_WRP=3V3_W VT_EN_WRP=FPGA_EN VT_VCC_WRP=GLOBAL_HIGH_POWER

### Buses and harness runs
bus IVL_W[15..0] = port IVL_WRP[15..0]
bus OVCC_W[15..0] = port OVCC_WRP[15..0]

### Notes on the sheet
- (in symbol 0.1uF_0603) 0.1uF | 0603

### Library data of the parts
LT1 LT2 = 8-Chanel Level Translator: IC XLATR LEVEL BIDIR 8CH 20TSSOP; Manufacturer: Maxim Integrated; Manufacturer Part Number: MAX3008EUP+; Translator Type: Voltage Level; Channel Type: Unidirectional; Number of Circuits: 1; Channels per Circuit: 8; Voltage - VCCA: 1.2 V ~ 5.5 V; Voltage - VCCB: 1.65 V ~ 5.5 V; Output Type: Tri-State, Non-Inverted; Data Rate: 35Mbps; Supplier 1: Digi-Key; RoHS: RoHS Compliant; Category: Integrated Circuits (ICs); Stock 1: 36; Pricing 1: 1=3.17, 10=3.012, 25=2.81, 50=2.7158 (USD); Packaging: Tube; Input Signal: -; Output Signal: -; Operating Temperature: -40°C ~ 85°C (TA); Features: Power Supply Decoupling; Mounting Type: Surface Mount; Package / Case: 20-TSSOP (0.173", 4.40mm Width); Supplier Device Package: 20-TSSOP; ComponentLink1URL: http://datasheets.maximintegrated.com/en/ds/MAX3000E-MAX3012.pdf; ComponentLink1Description: http://datasheets.maximintegrated.com/en/ds/MAX3000E-MAX3012.pdf; Supplier Part Number 1: MAX3008EUP+-ND

## Sheet DUT_HEADER.SchDoc
size A
Used 4 times, as channels U_DUT_HEADER, U_DUT_HEADER, U_DUT_HEADER, U_DUT_HEADER. Parts and nets are listed once, with the designators drawn on the sheet.
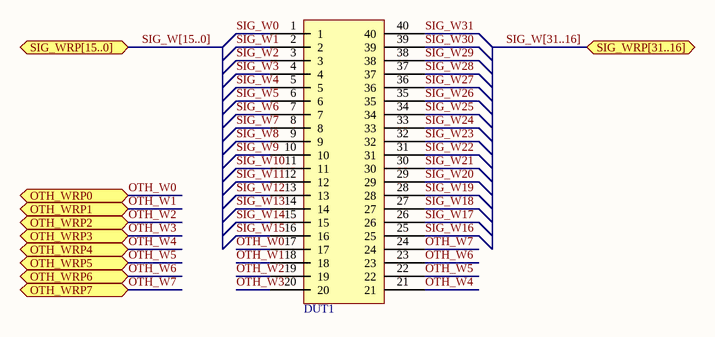
[diagram p4: DUT_HEADER.SchDoc]

### Parts
DUT1  ADAFRUIT_HEADER  [FEMALE_HEADER_SMD]  (value not drawn)

### Ports
OTH_WRP0, OTH_WRP1, OTH_WRP2, OTH_WRP3, OTH_WRP4, OTH_WRP5, OTH_WRP6, OTH_WRP7, SIG_WRP[15..0], SIG_WRP[31..16]

### Nets
OTH_W0: DUT1.17 ; port OTH_WRP0
OTH_W1: DUT1.18 ; port OTH_WRP1
OTH_W2: DUT1.19 ; port OTH_WRP2
OTH_W3: DUT1.20 ; port OTH_WRP3
OTH_W4: DUT1.21 ; port OTH_WRP4
OTH_W5: DUT1.22 ; port OTH_WRP5
OTH_W6: DUT1.23 ; port OTH_WRP6
OTH_W7: DUT1.24 ; port OTH_WRP7
SIG_W0: DUT1.1
SIG_W1: DUT1.2
SIG_W2: DUT1.3
SIG_W3: DUT1.4
SIG_W4: DUT1.5
SIG_W5: DUT1.6
SIG_W6: DUT1.7
SIG_W7: DUT1.8
SIG_W8: DUT1.9
SIG_W9: DUT1.10
SIG_W10: DUT1.11
SIG_W11: DUT1.12
SIG_W12: DUT1.13
SIG_W13: DUT1.14
SIG_W14: DUT1.15
SIG_W15: DUT1.16
SIG_W16: DUT1.25
SIG_W17: DUT1.26
SIG_W18: DUT1.27
SIG_W19: DUT1.28
SIG_W20: DUT1.29
SIG_W21: DUT1.30
SIG_W22: DUT1.31
SIG_W23: DUT1.32
SIG_W24: DUT1.33
SIG_W25: DUT1.34
SIG_W26: DUT1.35
SIG_W27: DUT1.36
SIG_W28: DUT1.37
SIG_W29: DUT1.38
SIG_W30: DUT1.39
SIG_W31: DUT1.40

### Channels
U_DUT_HEADER: designators end in _U_DUT_HEADER4; ports OTH_WRP0=FPGA_~CS1 OTH_WRP1=FPGA_~OE OTH_WRP2=FPGA_~WE1 OTH_WRP3=GND OTH_WRP4=GND OTH_WRP5=FPGA_EN OTH_WRP6=COUNTER_CLR OTH_WRP7=COUNTER_CLK0
U_DUT_HEADER: designators end in _U_DUT_HEADER3; ports OTH_WRP0=FPGA_~CS4 OTH_WRP1=FPGA_~WE4 OTH_WRP2=FPGA_~MR OTH_WRP3=FPGA_Q OTH_WRP4=FPGA_~PL OTH_WRP5=FPGA_SHCP OTH_WRP6=FPGA_STCP OTH_WRP7=COUNTER_CLK1
U_DUT_HEADER: designators end in _U_DUT_HEADER2; ports OTH_WRP0=FPGA_~CS2 OTH_WRP1=FPGA_~WE2 OTH_WRP2=3V3_W OTH_WRP3=GND OTH_WRP4=GND OTH_WRP5=GND OTH_WRP6=GLOBAL_HIGH_POWER OTH_WRP7=COUNTER_CLK2
U_DUT_HEADER: designators end in _U_DUT_HEADER1; ports OTH_WRP0=FPGA_~CS3 OTH_WRP1=FPGA_~WE3 OTH_WRP2=GND OTH_WRP3=GND OTH_WRP4=GND OTH_WRP5=GND OTH_WRP6=GND OTH_WRP7=COUNTER_CLK3

### Buses and harness runs
bus SIG_W[15..0] = port SIG_WRP[15..0]
bus SIG_W[31..16] = port SIG_WRP[31..16]

### Library data of the parts
DUT1 = ADAFRUIT_HEADER: Extra tall female header (SMD)

## Sheet NUMATO_HDR.SchDoc
size B
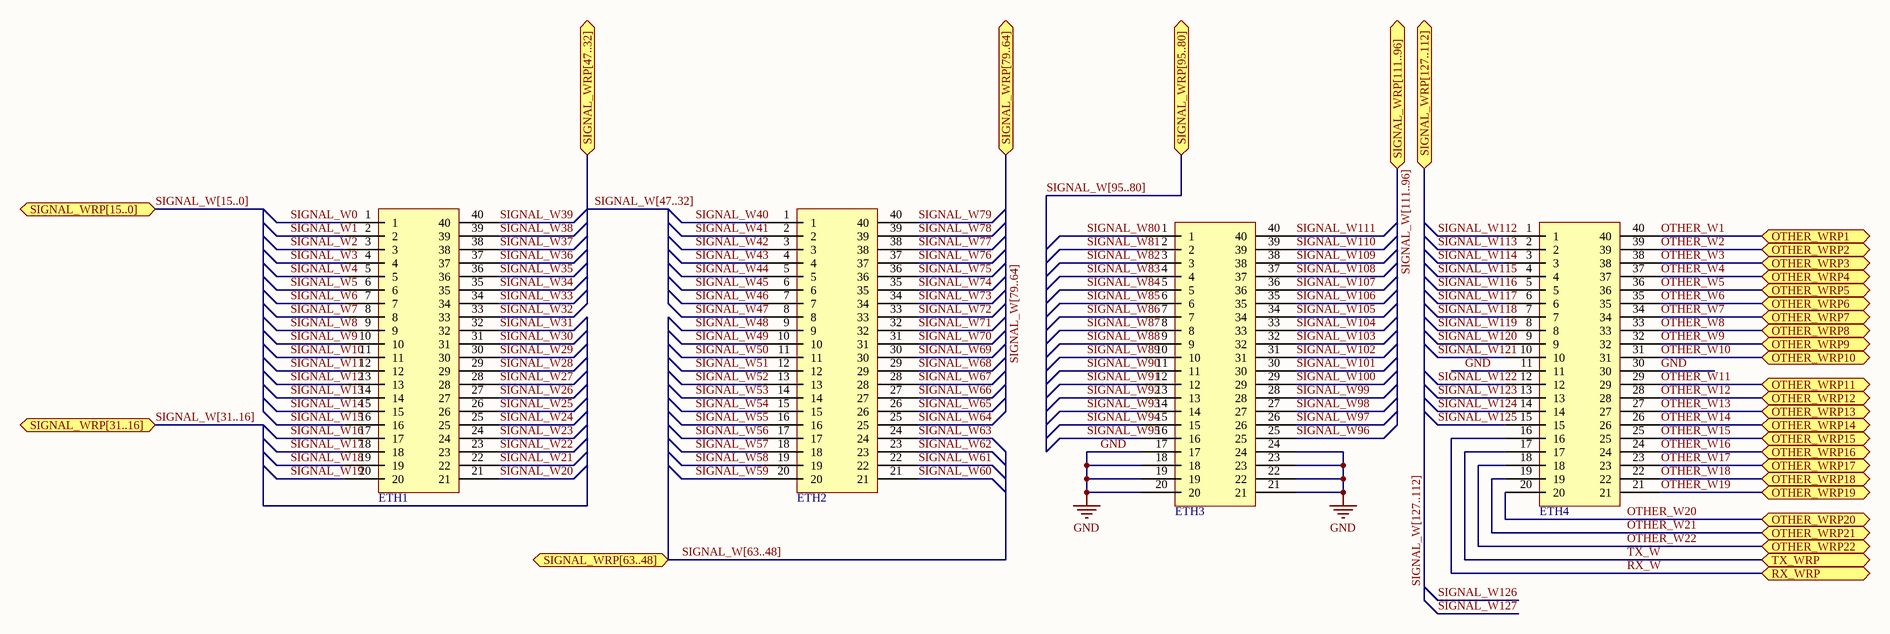
[diagram p5: NUMATO_HDR.SchDoc]

### Parts
ETH1  ADAFRUIT_HEADER  [FEMALE_HEADER_SMD]  (value not drawn)
ETH2  ADAFRUIT_HEADER  [FEMALE_HEADER_SMD]  (value not drawn)
ETH3  ADAFRUIT_HEADER  [FEMALE_HEADER_SMD]  (value not drawn)
ETH4  ADAFRUIT_HEADER  [FEMALE_HEADER_SMD]  (value not drawn)

### Ports
OTHER_WRP1, OTHER_WRP2, OTHER_WRP3, OTHER_WRP4, OTHER_WRP5, OTHER_WRP6, OTHER_WRP7, OTHER_WRP8, OTHER_WRP9, OTHER_WRP10, OTHER_WRP11, OTHER_WRP12, OTHER_WRP13, OTHER_WRP14, OTHER_WRP15, OTHER_WRP16, OTHER_WRP17, OTHER_WRP18, OTHER_WRP19, OTHER_WRP20, OTHER_WRP21, OTHER_WRP22, RX_WRP, SIGNAL_WRP[15..0], SIGNAL_WRP[31..16], SIGNAL_WRP[47..32], SIGNAL_WRP[63..48], SIGNAL_WRP[79..64], SIGNAL_WRP[95..80], SIGNAL_WRP[111..96], SIGNAL_WRP[127..112], TX_WRP

### Nets
GND: ETH3.17 ETH3.18 ETH3.19 ETH3.20 ETH3.21 ETH3.22 ETH3.23 ETH3.24 ETH4.11 ETH4.30
OTHER_W1: ETH4.40 ; port OTHER_WRP1  [project net FPGA_~CS1]
OTHER_W2: ETH4.39 ; port OTHER_WRP2  [project net FPGA_~OE]
OTHER_W3: ETH4.38 ; port OTHER_WRP3  [project net FPGA_~WE1]
OTHER_W4: ETH4.37 ; port OTHER_WRP4  [project net FPGA_EN]
OTHER_W5: ETH4.36 ; port OTHER_WRP5  [project net COUNTER_CLR]
OTHER_W6: ETH4.35 ; port OTHER_WRP6  [project net COUNTER_CLK0]
OTHER_W7: ETH4.34 ; port OTHER_WRP7  [project net FPGA_~CS4]
OTHER_W8: ETH4.33 ; port OTHER_WRP8  [project net FPGA_~WE4]
OTHER_W9: ETH4.32 ; port OTHER_WRP9  [project net FPGA_~MR]
OTHER_W10: ETH4.31 ; port OTHER_WRP10  [project net FPGA_~PL]
OTHER_W11: ETH4.29 ; port OTHER_WRP11  [project net FPGA_SHCP]
OTHER_W12: ETH4.28 ; port OTHER_WRP12  [project net FPGA_STCP]
OTHER_W13: ETH4.27 ; port OTHER_WRP13  [project net FPGA_~CS2]
OTHER_W14: ETH4.26 ; port OTHER_WRP14  [project net FPGA_~WE2]
OTHER_W15: ETH4.25 ; port OTHER_WRP15  [project net COUNTER_CLK1]
OTHER_W16: ETH4.24 ; port OTHER_WRP16  [project net FPGA_~CS3]
OTHER_W17: ETH4.23 ; port OTHER_WRP17  [project net FPGA_~WE3]
OTHER_W18: ETH4.22 ; port OTHER_WRP18  [project net COUNTER_CLK2]
OTHER_W19: ETH4.21 ; port OTHER_WRP19  [project net COUNTER_CLK3]
OTHER_W20: ETH4.20 ; port OTHER_WRP20
OTHER_W21: ETH4.19 ; port OTHER_WRP21
OTHER_W22: ETH4.18 ; port OTHER_WRP22  [project net FPGA_Q]
RX_W: ETH4.16 ; port RX_WRP  [project net FPGA_RX]
SIGNAL_W0: ETH1.1  [project net FPGA_SIG0]
SIGNAL_W1: ETH1.2  [project net FPGA_SIG1]
SIGNAL_W2: ETH1.3  [project net FPGA_SIG2]
SIGNAL_W3: ETH1.4  [project net FPGA_SIG3]
SIGNAL_W4: ETH1.5  [project net FPGA_SIG4]
SIGNAL_W5: ETH1.6  [project net FPGA_SIG5]
SIGNAL_W6: ETH1.7  [project net FPGA_SIG6]
SIGNAL_W7: ETH1.8  [project net FPGA_SIG7]
SIGNAL_W8: ETH1.9  [project net FPGA_SIG8]
SIGNAL_W9: ETH1.10  [project net FPGA_SIG9]
SIGNAL_W10: ETH1.11  [project net FPGA_SIG10]
SIGNAL_W11: ETH1.12  [project net FPGA_SIG11]
SIGNAL_W12: ETH1.13  [project net FPGA_SIG12]
SIGNAL_W13: ETH1.14  [project net FPGA_SIG13]
SIGNAL_W14: ETH1.15  [project net FPGA_SIG14]
SIGNAL_W15: ETH1.16  [project net FPGA_SIG15]
SIGNAL_W16: ETH1.17  [project net FPGA_SIG16]
SIGNAL_W17: ETH1.18  [project net FPGA_SIG17]
SIGNAL_W18: ETH1.19  [project net FPGA_SIG18]
SIGNAL_W19: ETH1.20  [project net FPGA_SIG19]
SIGNAL_W20: ETH1.21  [project net FPGA_SIG20]
SIGNAL_W21: ETH1.22  [project net FPGA_SIG21]
SIGNAL_W22: ETH1.23  [project net FPGA_SIG22]
SIGNAL_W23: ETH1.24  [project net FPGA_SIG23]
SIGNAL_W24: ETH1.25  [project net FPGA_SIG24]
SIGNAL_W25: ETH1.26  [project net FPGA_SIG25]
SIGNAL_W26: ETH1.27  [project net FPGA_SIG26]
SIGNAL_W27: ETH1.28  [project net FPGA_SIG27]
SIGNAL_W28: ETH1.29  [project net FPGA_SIG28]
SIGNAL_W29: ETH1.30  [project net FPGA_SIG29]
SIGNAL_W30: ETH1.31  [project net FPGA_SIG30]
SIGNAL_W31: ETH1.32  [project net FPGA_SIG31]
SIGNAL_W32: ETH1.33  [project net FPGA_SIG32]
SIGNAL_W33: ETH1.34  [project net FPGA_SIG33]
SIGNAL_W34: ETH1.35  [project net FPGA_SIG34]
SIGNAL_W35: ETH1.36  [project net FPGA_SIG35]
SIGNAL_W36: ETH1.37  [project net FPGA_SIG36]
SIGNAL_W37: ETH1.38  [project net FPGA_SIG37]
SIGNAL_W38: ETH1.39  [project net FPGA_SIG38]
SIGNAL_W39: ETH1.40  [project net FPGA_SIG39]
SIGNAL_W40: ETH2.1  [project net FPGA_SIG40]
SIGNAL_W41: ETH2.2  [project net FPGA_SIG41]
SIGNAL_W42: ETH2.3  [project net FPGA_SIG42]
SIGNAL_W43: ETH2.4  [project net FPGA_SIG43]
SIGNAL_W44: ETH2.5  [project net FPGA_SIG44]
SIGNAL_W45: ETH2.6  [project net FPGA_SIG45]
SIGNAL_W46: ETH2.7  [project net FPGA_SIG46]
SIGNAL_W47: ETH2.8  [project net FPGA_SIG47]
SIGNAL_W48: ETH2.9  [project net FPGA_SIG48]
SIGNAL_W49: ETH2.10  [project net FPGA_SIG49]
SIGNAL_W50: ETH2.11  [project net FPGA_SIG50]
SIGNAL_W51: ETH2.12  [project net FPGA_SIG51]
SIGNAL_W52: ETH2.13  [project net FPGA_SIG52]
SIGNAL_W53: ETH2.14  [project net FPGA_SIG53]
SIGNAL_W54: ETH2.15  [project net FPGA_SIG54]
SIGNAL_W55: ETH2.16  [project net FPGA_SIG55]
SIGNAL_W56: ETH2.17  [project net FPGA_SIG56]
SIGNAL_W57: ETH2.18  [project net FPGA_SIG57]
SIGNAL_W58: ETH2.19  [project net FPGA_SIG58]
SIGNAL_W59: ETH2.20  [project net FPGA_SIG59]
SIGNAL_W60: ETH2.21  [project net FPGA_SIG60]
SIGNAL_W61: ETH2.22  [project net FPGA_SIG61]
SIGNAL_W62: ETH2.23  [project net FPGA_SIG62]
SIGNAL_W63: ETH2.24  [project net FPGA_SIG63]
SIGNAL_W64: ETH2.25  [project net FPGA_SIG64]
SIGNAL_W65: ETH2.26  [project net FPGA_SIG65]
SIGNAL_W66: ETH2.27  [project net FPGA_SIG66]
SIGNAL_W67: ETH2.28  [project net FPGA_SIG67]
SIGNAL_W68: ETH2.29  [project net FPGA_SIG68]
SIGNAL_W69: ETH2.30  [project net FPGA_SIG69]
SIGNAL_W70: ETH2.31  [project net FPGA_SIG70]
SIGNAL_W71: ETH2.32  [project net FPGA_SIG71]
SIGNAL_W72: ETH2.33  [project net FPGA_SIG72]
SIGNAL_W73: ETH2.34  [project net FPGA_SIG73]
SIGNAL_W74: ETH2.35  [project net FPGA_SIG74]
SIGNAL_W75: ETH2.36  [project net FPGA_SIG75]
SIGNAL_W76: ETH2.37  [project net FPGA_SIG76]
SIGNAL_W77: ETH2.38  [project net FPGA_SIG77]
SIGNAL_W78: ETH2.39  [project net FPGA_SIG78]
SIGNAL_W79: ETH2.40  [project net FPGA_SIG79]
SIGNAL_W80: ETH3.1  [project net FPGA_SIG80]
SIGNAL_W81: ETH3.2  [project net FPGA_SIG81]
SIGNAL_W82: ETH3.3  [project net FPGA_SIG82]
SIGNAL_W83: ETH3.4  [project net FPGA_SIG83]
SIGNAL_W84: ETH3.5  [project net FPGA_SIG84]
SIGNAL_W85: ETH3.6  [project net FPGA_SIG85]
SIGNAL_W86: ETH3.7  [project net FPGA_SIG86]
SIGNAL_W87: ETH3.8  [project net FPGA_SIG87]
SIGNAL_W88: ETH3.9  [project net FPGA_SIG88]
SIGNAL_W89: ETH3.10  [project net FPGA_SIG89]
SIGNAL_W90: ETH3.11  [project net FPGA_SIG90]
SIGNAL_W91: ETH3.12  [project net FPGA_SIG91]
SIGNAL_W92: ETH3.13  [project net FPGA_SIG92]
SIGNAL_W93: ETH3.14  [project net FPGA_SIG93]
SIGNAL_W94: ETH3.15  [project net FPGA_SIG94]
SIGNAL_W95: ETH3.16  [project net FPGA_SIG95]
SIGNAL_W96: ETH3.25  [project net FPGA_SIG96]
SIGNAL_W97: ETH3.26  [project net FPGA_SIG97]
SIGNAL_W98: ETH3.27  [project net FPGA_SIG98]
SIGNAL_W99: ETH3.28  [project net FPGA_SIG99]
SIGNAL_W100: ETH3.29  [project net FPGA_SIG100]
SIGNAL_W101: ETH3.30  [project net FPGA_SIG101]
SIGNAL_W102: ETH3.31  [project net FPGA_SIG102]
SIGNAL_W103: ETH3.32  [project net FPGA_SIG103]
SIGNAL_W104: ETH3.33  [project net FPGA_SIG104]
SIGNAL_W105: ETH3.34  [project net FPGA_SIG105]
SIGNAL_W106: ETH3.35  [project net FPGA_SIG106]
SIGNAL_W107: ETH3.36  [project net FPGA_SIG107]
SIGNAL_W108: ETH3.37  [project net FPGA_SIG108]
SIGNAL_W109: ETH3.38  [project net FPGA_SIG109]
SIGNAL_W110: ETH3.39  [project net FPGA_SIG110]
SIGNAL_W111: ETH3.40  [project net FPGA_SIG111]
SIGNAL_W112: ETH4.1  [project net FPGA_SIG112]
SIGNAL_W113: ETH4.2  [project net FPGA_SIG113]
SIGNAL_W114: ETH4.3  [project net FPGA_SIG114]
SIGNAL_W115: ETH4.4  [project net FPGA_SIG115]
SIGNAL_W116: ETH4.5  [project net FPGA_SIG116]
SIGNAL_W117: ETH4.6  [project net FPGA_SIG117]
SIGNAL_W118: ETH4.7  [project net FPGA_SIG118]
SIGNAL_W119: ETH4.8  [project net FPGA_SIG119]
SIGNAL_W120: ETH4.9  [project net FPGA_SIG120]
SIGNAL_W121: ETH4.10  [project net FPGA_SIG121]
SIGNAL_W122: ETH4.12  [project net FPGA_SIG122]
SIGNAL_W123: ETH4.13  [project net FPGA_SIG123]
SIGNAL_W124: ETH4.14  [project net FPGA_SIG124]
SIGNAL_W125: ETH4.15  [project net FPGA_SIG125]
TX_W: ETH4.17 ; port TX_WRP  [project net FPGA_TX]

### Buses and harness runs
bus SIGNAL_W[15..0] = port SIGNAL_WRP[15..0]
bus SIGNAL_W[31..16] = port SIGNAL_WRP[31..16]
bus SIGNAL_W[47..32] = port SIGNAL_WRP[47..32]
bus SIGNAL_W[63..48] = port SIGNAL_WRP[63..48]
bus SIGNAL_W[79..64] = port SIGNAL_WRP[79..64]
bus SIGNAL_W[95..80] = port SIGNAL_WRP[95..80]
bus SIGNAL_W[111..96] = port SIGNAL_WRP[111..96]
bus SIGNAL_W[127..112] = port SIGNAL_WRP[127..112]

### Library data of the parts
ETH1-ETH4 = ADAFRUIT_HEADER: Extra tall female header (SMD)